# EAGLE design rings_v30 (EAGLE 5.09)

## Sheet 1 of 5
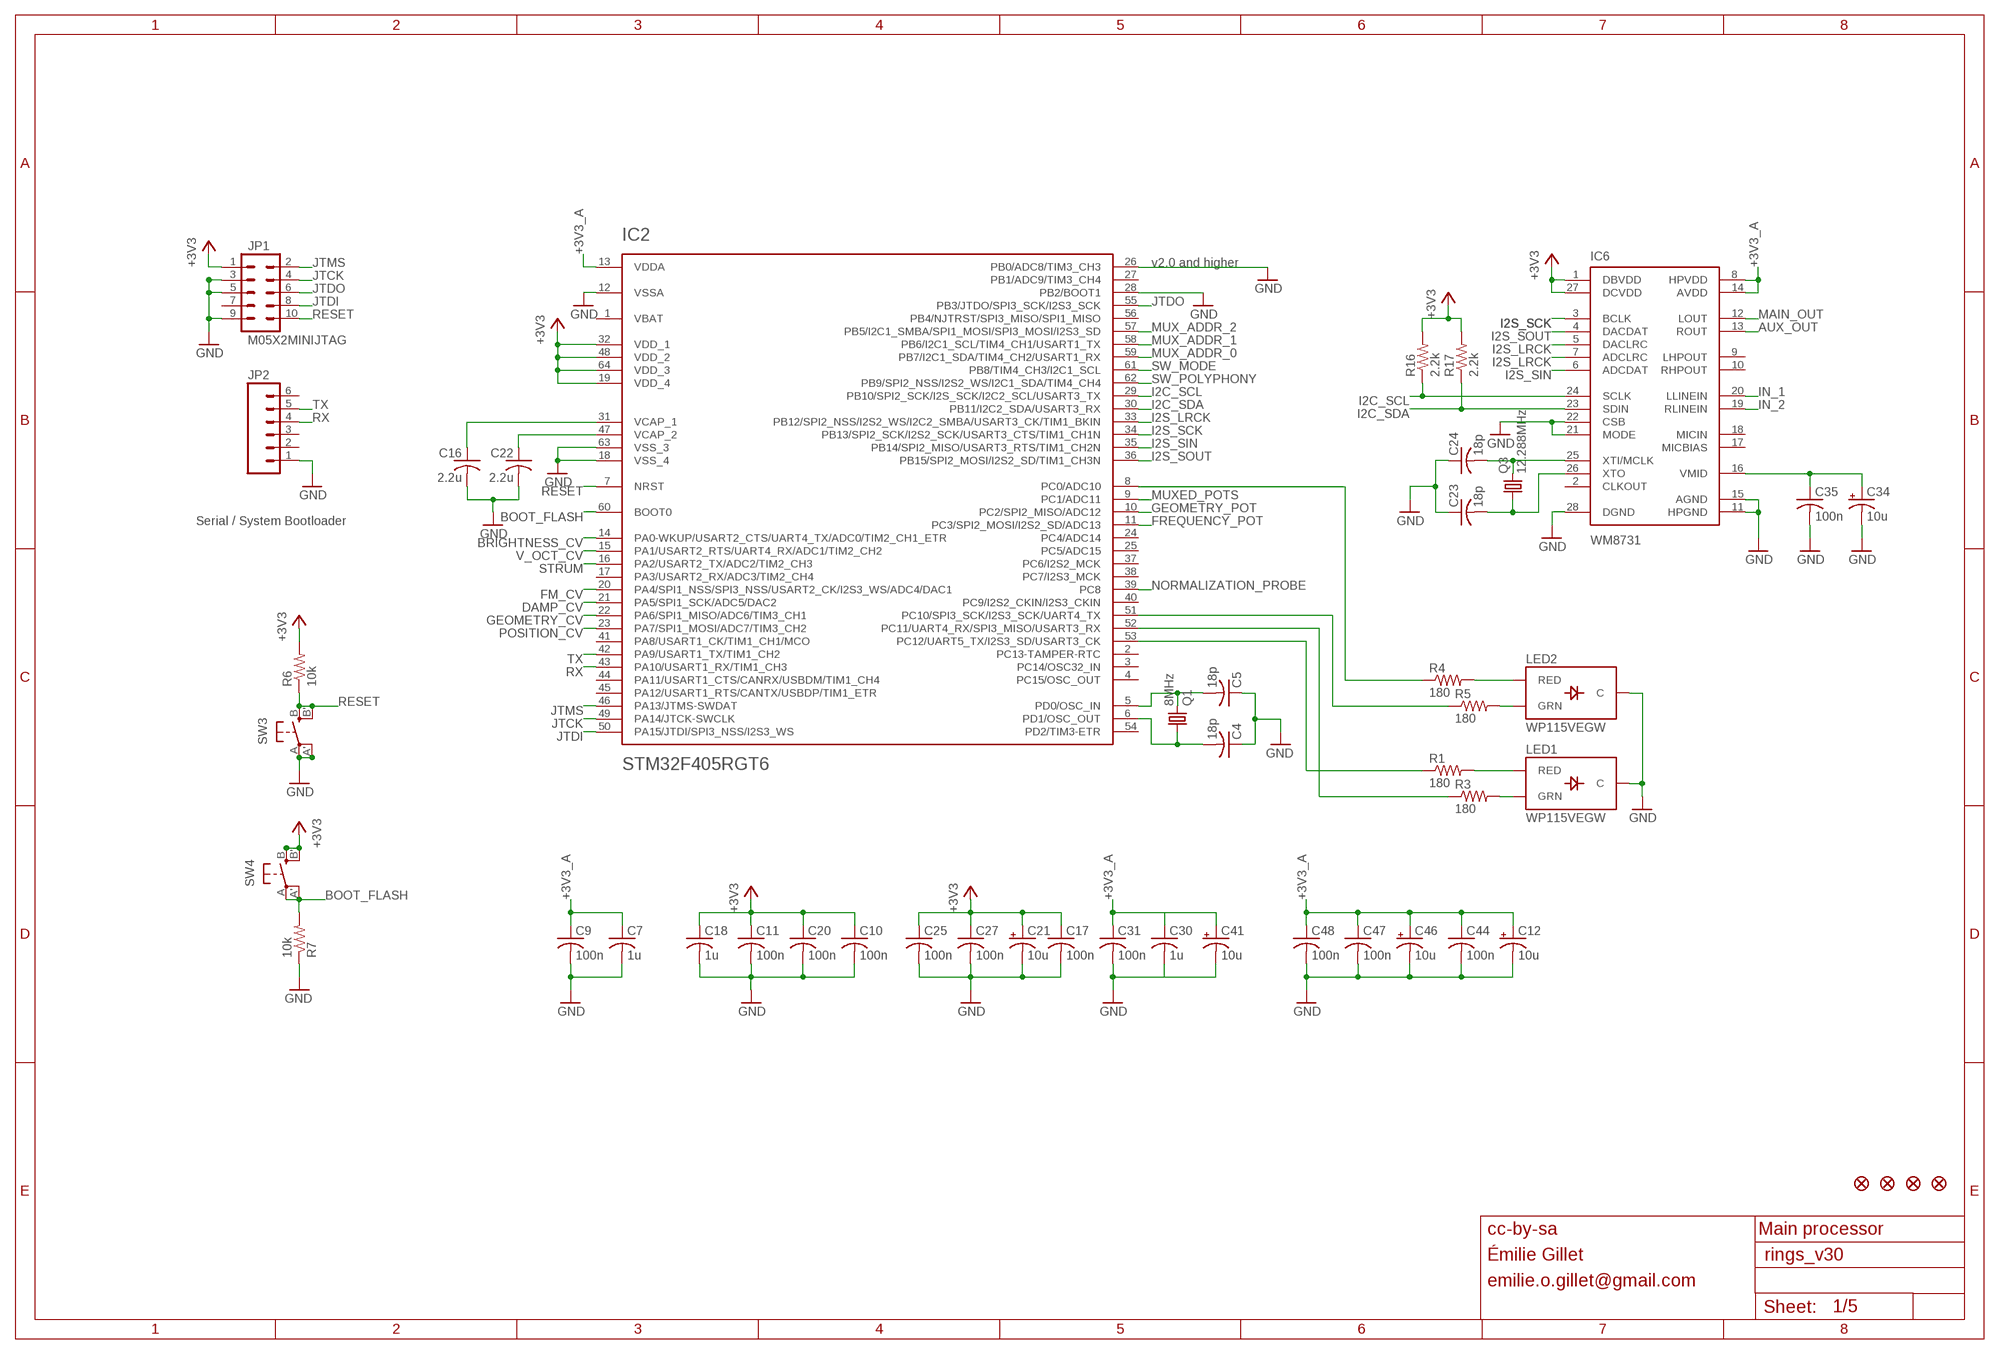
[diagram p0: schematic, sheet 1]

### Parts
C4  18p  C-USC0603  [C0603]
C5  18p  C-USC0603  [C0603]
C7  1u  C-USC0603  [C0603]
C9  100n  C-USC0603  [C0603]
C10  100n  C-USC0603  [C0603]
C11  100n  C-USC0603  [C0603]
C12  10u  CPOL-USA  [PANASONIC_A]
C16  2.2u  C-USC0805  [C0805]
C17  100n  C-USC0603  [C0603]
C18  1u  C-USC0603  [C0603]
C20  100n  C-USC0603  [C0603]
C21  10u  CPOL-USA  [PANASONIC_A]
C22  2.2u  C-USC0805  [C0805]
C23  18p  C-USC0603  [C0603]
C24  18p  C-USC0603  [C0603]
C25  100n  C-USC0603  [C0603]
C27  100n  C-USC0603  [C0603]
C30  1u  C-USC0603  [C0603]
C31  100n  C-USC0603  [C0603]
C34  10u  CPOL-USA  [PANASONIC_A]
C35  100n  C-USC0603  [C0603]
C41  10u  CPOL-USA  [PANASONIC_A]
C44  100n  C-USC0603  [C0603]
C46  10u  CPOL-USA  [PANASONIC_A]
C47  100n  C-USC0603  [C0603]
C48  100n  C-USC0603  [C0603]
F1  FIDUCIAL1X2  [FIDUCIAL-1X2]
F2  FIDUCIAL1X2  [FIDUCIAL-1X2]
F3  FIDUCIAL1X2  [FIDUCIAL-1X2]
F4  FIDUCIAL1X2  [FIDUCIAL-1X2]
IC2  STM32F405RGT6  STM32F20X  [TQFP-10X10-64]
IC6  WM8731  [SSOP28]
JP1  M05X2MINIJTAG  [2X5-1.27]
JP2  M06SIP  [1X06]
LED1  WP115VEGW  LED-BICOLOR-THROUGHHOLE  [LED-BICOLOR-THROUGHHOLE]
LED2  WP115VEGW  LED-BICOLOR-THROUGHHOLE  [LED-BICOLOR-THROUGHHOLE]
Q1  8MHz  CRYSTALHC49UP  [HC49UP]
Q3  12.288MHz  CRYSTALHC49UP  [HC49UP]
R1  180  R-US_R0603  [R0603]
R3  180  R-US_R0603  [R0603]
R4  180  R-US_R0603  [R0603]
R5  180  R-US_R0603  [R0603]
R6  10k  R-US_R0603  [R0603]
R7  10k  R-US_R0603  [R0603]
R16  2.2k  R-US_R0603  [R0603]
R17  2.2k  R-US_R0603  [R0603]
SW3  EVQQ2  [EVQ-Q2]
SW4  EVQQ2  [EVQ-Q2]

### Nets
+3V3: C10.1 C11.1 C17.1 C18.1 C20.1 C21.+ C25.1 C27.1 IC2.19(VDD_4) IC2.32(VDD_1) IC2.48(VDD_2) IC2.64(VDD_3) IC6.1(DBVDD) IC6.27(DCVDD) JP1.1 R6.2 R16.2 R17.2 SW4.B'(S1) SW4.B(S) ; also sheet 4,5
+3V3_A: C7.1 C9.1 C12.+ C30.1 C31.1 C41.+ C44.1 C46.+ C47.1 C48.1 IC2.13(VDDA) IC6.8(HPVDD) IC6.14(AVDD) ; also sheet 2,3,5
AUX_OUT: IC6.13(ROUT) ; also sheet 4
BOOT_FLASH: IC2.60(BOOT0) R7.2 SW4.A'(P1) SW4.A(P)
BRIGHTNESS_CV: IC2.14(PA0-WKUP/USART2_CTS/UART4_TX/ADC0/TIM2_CH1_ETR) ; also sheet 3
DAMP_CV: IC2.21(PA5/SPI1_SCK/ADC5/DAC2) ; also sheet 3
FM_CV: IC2.20(PA4/SPI1_NSS/SPI3_NSS/USART2_CK/I2S3_WS/ADC4/DAC1) ; also sheet 3
FREQUENCY_POT: IC2.11(PC3/SPI2_MOSI/I2S2_SD/ADC13) ; also sheet 2
GEOMETRY_CV: IC2.22(PA6/SPI1_MISO/ADC6/TIM3_CH1) ; also sheet 3
GEOMETRY_POT: IC2.10(PC2/SPI2_MISO/ADC12) ; also sheet 2
GND: C4.1 C5.1 C7.2 C9.2 C10.2 C11.2 C12.- C16.2 C17.2 C18.2 C20.2 C21.- C22.2 C23.1 C24.1 C25.2 C27.2 C30.2 C31.2 C34.- C35.2 C41.- C44.2 C46.- C47.2 C48.2 IC2.12(VSSA) IC2.18(VSS_4) IC2.26(PB0/ADC8/TIM3_CH3) IC2.28(PB2/BOOT1) IC2.63(VSS_3) IC6.11(HPGND) IC6.15(AGND) IC6.21(MODE) IC6.22(CSB) IC6.28(DGND) JP1.3 JP1.5 JP1.9 JP2.1 LED1.2(C) LED2.2(C) R7.1 SW3.A'(P1) SW3.A(P) ; also sheet 2,3,4,5
I2C_SCL: IC2.29(PB10/SPI2_SCK/I2S_SCK/I2C2_SCL/USART3_TX) IC6.24(SCLK) R16.1
I2C_SDA: IC2.30(PB11/I2C2_SDA/USART3_RX) IC6.23(SDIN) R17.1
I2S_LRCK: IC2.33(PB12/SPI2_NSS/I2S2_WS/I2C2_SMBA/USART3_CK/TIM1_BKIN) IC6.5(DACLRC) IC6.7(ADCLRC)
I2S_SCK: IC2.34(PB13/SPI2_SCK/I2S2_SCK/USART3_CTS/TIM1_CH1N) IC6.3(BCLK)
I2S_SIN: IC2.35(PB14/SPI2_MISO/USART3_RTS/TIM1_CH2N) IC6.6(ADCDAT)
I2S_SOUT: IC2.36(PB15/SPI2_MOSI/I2S2_SD/TIM1_CH3N) IC6.4(DACDAT)
IN_1: IC6.20(LLINEIN) ; also sheet 4
IN_2: IC6.19(RLINEIN) ; also sheet 4
JTCK: IC2.49(PA14/JTCK-SWCLK) JP1.4
JTDI: IC2.50(PA15/JTDI/SPI3_NSS/I2S3_WS) JP1.8
JTDO: IC2.55(PB3/JTDO/SPI3_SCK/I2S3_SCK) JP1.6
JTMS: IC2.46(PA13/JTMS-SWDAT) JP1.2
MAIN_OUT: IC6.12(LOUT) ; also sheet 4
MUX_ADDR_0: IC2.59(PB7/I2C1_SDA/TIM4_CH2/USART1_RX) ; also sheet 2
MUX_ADDR_1: IC2.58(PB6/I2C1_SCL/TIM4_CH1/USART1_TX) ; also sheet 2
MUX_ADDR_2: IC2.57(PB5/I2C1_SMBA/SPI1_MOSI/SPI3_MOSI/I2S3_SD) ; also sheet 2
MUXED_POTS: IC2.9(PC1/ADC11) ; also sheet 2
N$7: C5.2 IC2.5(PD0/OSC_IN) Q1.2
N$8: C4.2 IC2.6(PD1/OSC_OUT) Q1.1
N$12: LED1.3(RED) R1.2
N$13: C22.1 IC2.47(VCAP_2)
N$17: C34.+ C35.1 IC6.16(VMID)
N$19: C16.1 IC2.31(VCAP_1)
N$22: LED1.1(GRN) R3.2
N$27: LED2.3(RED) R4.2
N$35: LED2.1(GRN) R5.2
N$37: IC2.52(PC11/UART4_RX/SPI3_MISO/USART3_RX) R3.1
N$40: IC2.8(PC0/ADC10) R4.1
N$41: C24.2 IC6.25(XTI/MCLK) Q3.2
N$42: C23.2 IC6.26(XTO) Q3.1
N$43: IC2.53(PC12/UART5_TX/I2S3_SD/USART3_CK) R1.1
N$44: IC2.51(PC10/SPI3_SCK/I2S3_SCK/UART4_TX) R5.1
NORMALIZATION_PROBE: IC2.39(PC8) ; also sheet 4
POSITION_CV: IC2.23(PA7/SPI1_MOSI/ADC7/TIM3_CH2) ; also sheet 3
RESET: IC2.7(NRST) JP1.10 R6.1 SW3.B'(S1) SW3.B(S)
RX: IC2.43(PA10/USART1_RX/TIM1_CH3) JP2.4
STRUM: IC2.16(PA2/USART2_TX/ADC2/TIM2_CH3) ; also sheet 4
SW_MODE: IC2.61(PB8/TIM4_CH3/I2C1_SCL) ; also sheet 2
SW_POLYPHONY: IC2.62(PB9/SPI2_NSS/I2S2_WS/I2C1_SDA/TIM4_CH4) ; also sheet 2
TX: IC2.42(PA9/USART1_TX/TIM1_CH2) JP2.5
V_OCT_CV: IC2.15(PA1/USART2_RTS/UART4_RX/ADC1/TIM2_CH2) ; also sheet 3
Unconnected: IC2.2(PC13-TAMPER-RTC) IC2.3(PC14/OSC32_IN) IC2.4(PC15/OSC_OUT) IC2.17(PA3/USART2_RX/ADC3/TIM2_CH4) IC2.24(PC4/ADC14) IC2.25(PC5/ADC15) IC2.27(PB1/ADC9/TIM3_CH4) IC2.37(PC6/I2S2_MCK) IC2.38(PC7/I2S3_MCK) IC2.40(PC9/I2S2_CKIN/I2S3_CKIN) IC2.41(PA8/USART1_CK/TIM1_CH1/MCO) IC2.44(PA11/USART1_CTS/CANRX/USBDM/TIM1_CH4) IC2.45(PA12/USART1_RTS/CANTX/USBDP/TIM1_ETR) IC2.54(PD2/TIM3-ETR) IC2.56(PB4/NJTRST/SPI3_MISO/SPI1_MISO) IC6.2(CLKOUT) IC6.9(LHPOUT) IC6.10(RHPOUT) IC6.17(MICBIAS) IC6.18(MICIN) JP1.7 JP2.2 JP2.3 JP2.6

### Notes on the sheet
- v2.0 and higher
- Serial / System Bootloader
- cc-by-sa | Main processor
- Émilie Gillet
- emilie.o.gillet@gmail.com

## Sheet 2 of 5
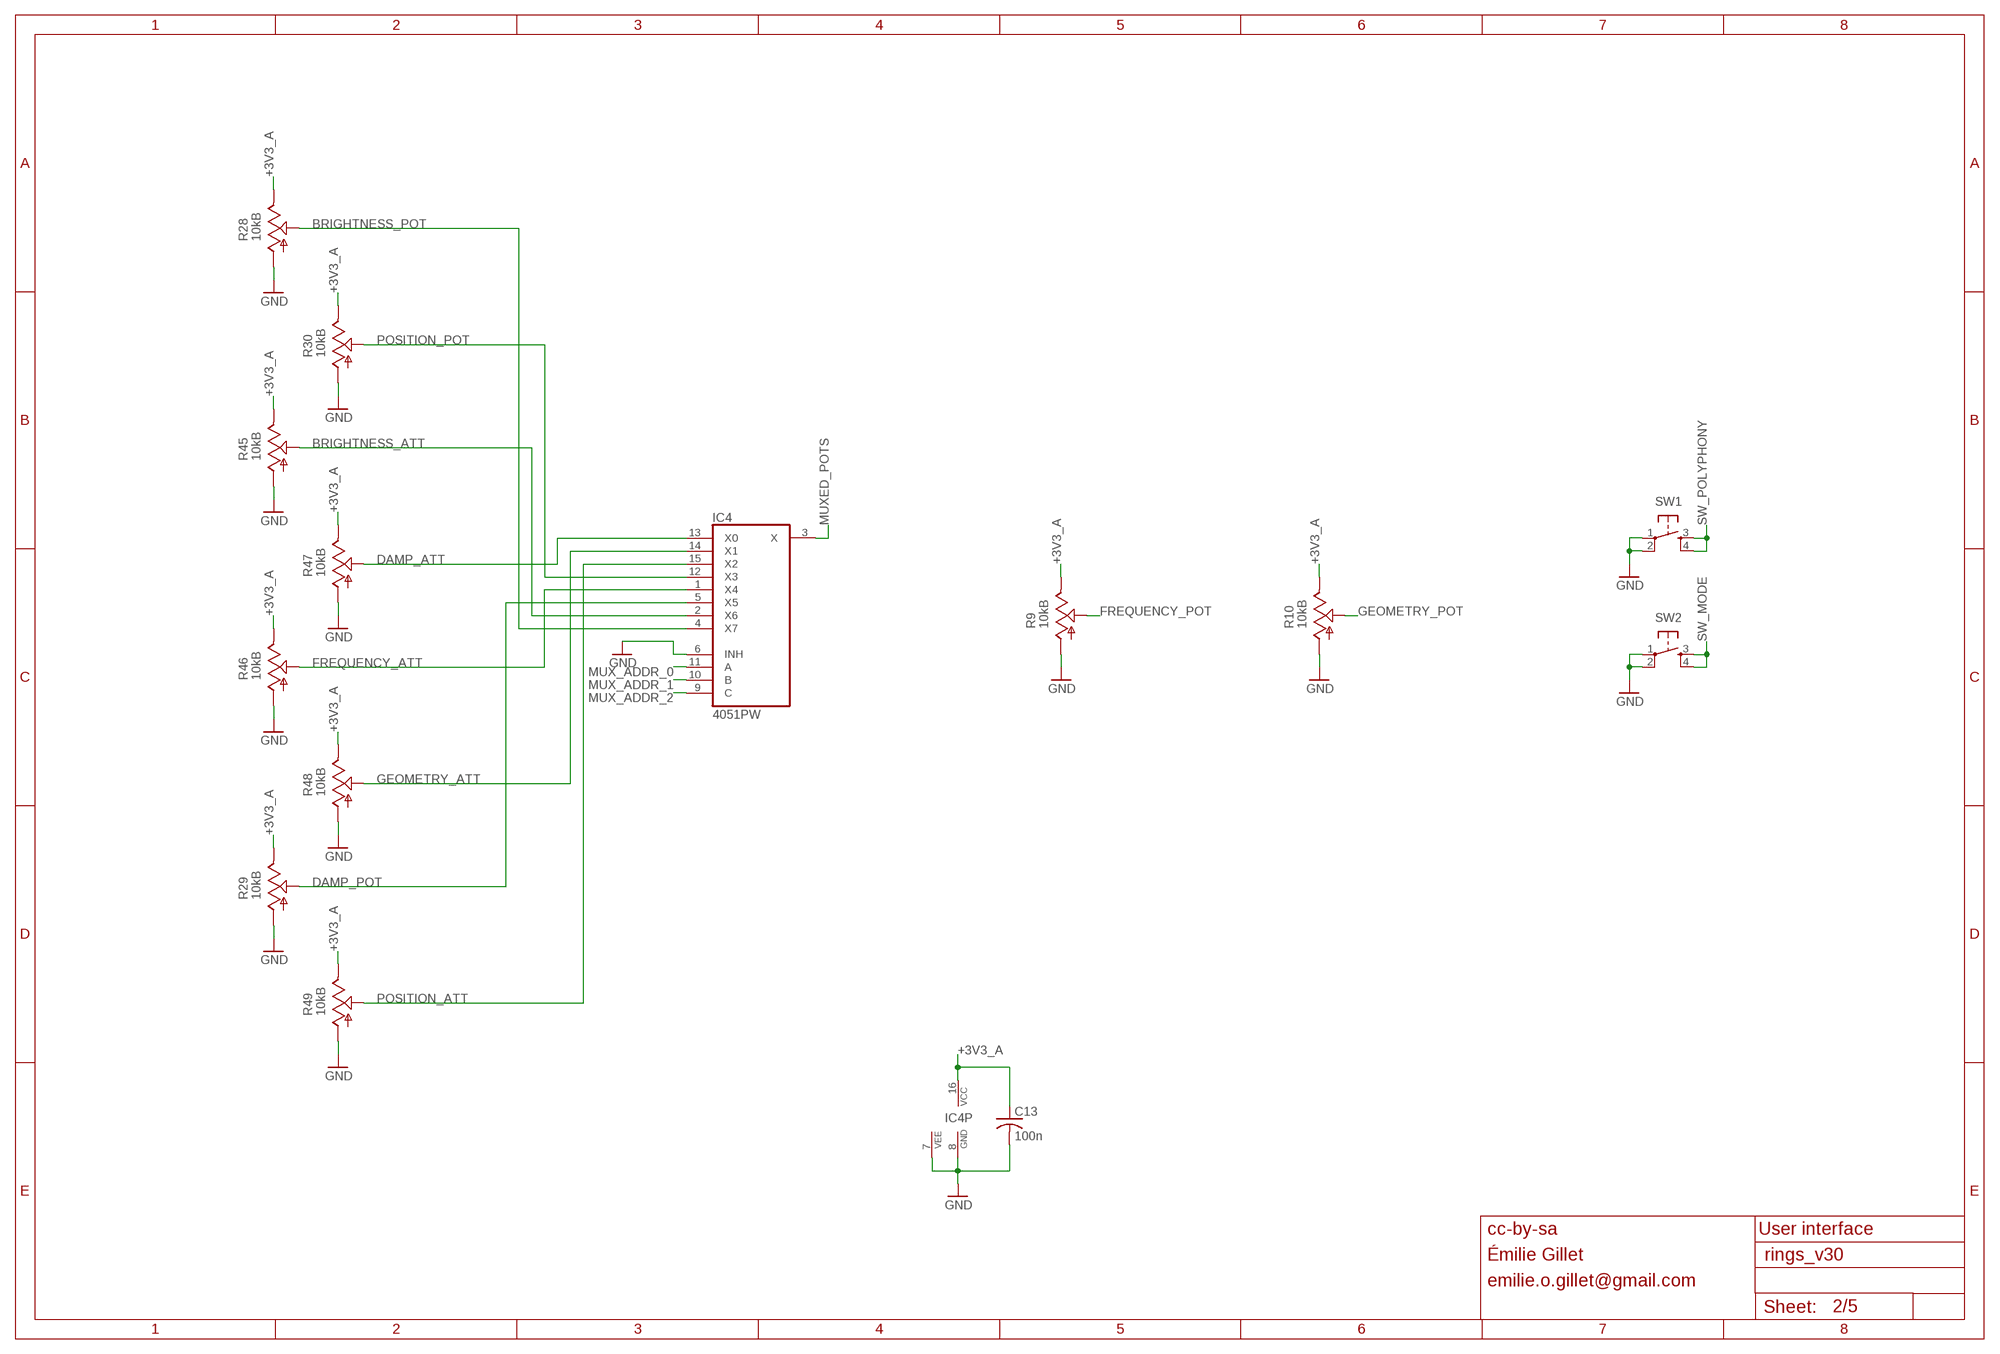
[diagram p1: schematic, sheet 2]

### Parts
C13  100n  C-USC0603  [C0603]
IC4  4051PW  [TSSOP16]
R9  10kB  POT_USVERTICAL_PS  [ALPS_POT_VERTICAL_PS]
R10  10kB  POT_USVERTICAL_PS  [ALPS_POT_VERTICAL_PS]
R28  10kB  POT_USVERTICAL_PS  [ALPS_POT_VERTICAL_PS]
R29  10kB  POT_USVERTICAL_PS  [ALPS_POT_VERTICAL_PS]
R30  10kB  POT_USVERTICAL_PS  [ALPS_POT_VERTICAL_PS]
R45  10kB  POT_USVERTICAL  [ALPS_POT_VERTICAL]
R46  10kB  POT_USVERTICAL  [ALPS_POT_VERTICAL]
R47  10kB  POT_USVERTICAL  [ALPS_POT_VERTICAL]
R48  10kB  POT_USVERTICAL  [ALPS_POT_VERTICAL]
R49  10kB  POT_USVERTICAL  [ALPS_POT_VERTICAL]
SW1  TAC_SWITCHPTH  [TACTILE-PTH]
SW2  TAC_SWITCHPTH  [TACTILE-PTH]

### Nets
+3V3_A: C13.1 IC4.16(VCC) R9.P$1(E) R10.P$1(E) R28.P$1(E) R29.P$1(E) R30.P$1(E) R45.P$1(E) R46.P$1(E) R47.P$1(E) R48.P$1(E) R49.P$1(E) ; also sheet 1,3,5
BRIGHTNESS_ATT: IC4.2(X6) R45.P$2(S)
BRIGHTNESS_POT: IC4.4(X7) R28.P$2(S)
DAMP_ATT: IC4.13(X0) R47.P$2(S)
DAMP_POT: IC4.5(X5) R29.P$2(S)
FREQUENCY_ATT: IC4.1(X4) R46.P$2(S)
FREQUENCY_POT: R9.P$2(S) ; also sheet 1
GEOMETRY_ATT: IC4.14(X1) R48.P$2(S)
GEOMETRY_POT: R10.P$2(S) ; also sheet 1
GND: C13.2 IC4.6(INH) IC4.7(VEE) IC4.8(GND) R9.P$3(A) R10.P$3(A) R28.P$3(A) R29.P$3(A) R30.P$3(A) R45.P$3(A) R46.P$3(A) R47.P$3(A) R48.P$3(A) R49.P$3(A) SW1.1 SW1.2 SW2.1 SW2.2 ; also sheet 1,3,4,5
MUX_ADDR_0: IC4.11(A) ; also sheet 1
MUX_ADDR_1: IC4.10(B) ; also sheet 1
MUX_ADDR_2: IC4.9(C) ; also sheet 1
MUXED_POTS: IC4.3(X) ; also sheet 1
POSITION_ATT: IC4.15(X2) R49.P$2(S)
POSITION_POT: IC4.12(X3) R30.P$2(S)
SW_MODE: SW2.3 SW2.4 ; also sheet 1
SW_POLYPHONY: SW1.3 SW1.4 ; also sheet 1

### Notes on the sheet
- cc-by-sa | User interface
- Émilie Gillet
- emilie.o.gillet@gmail.com

## Sheet 3 of 5
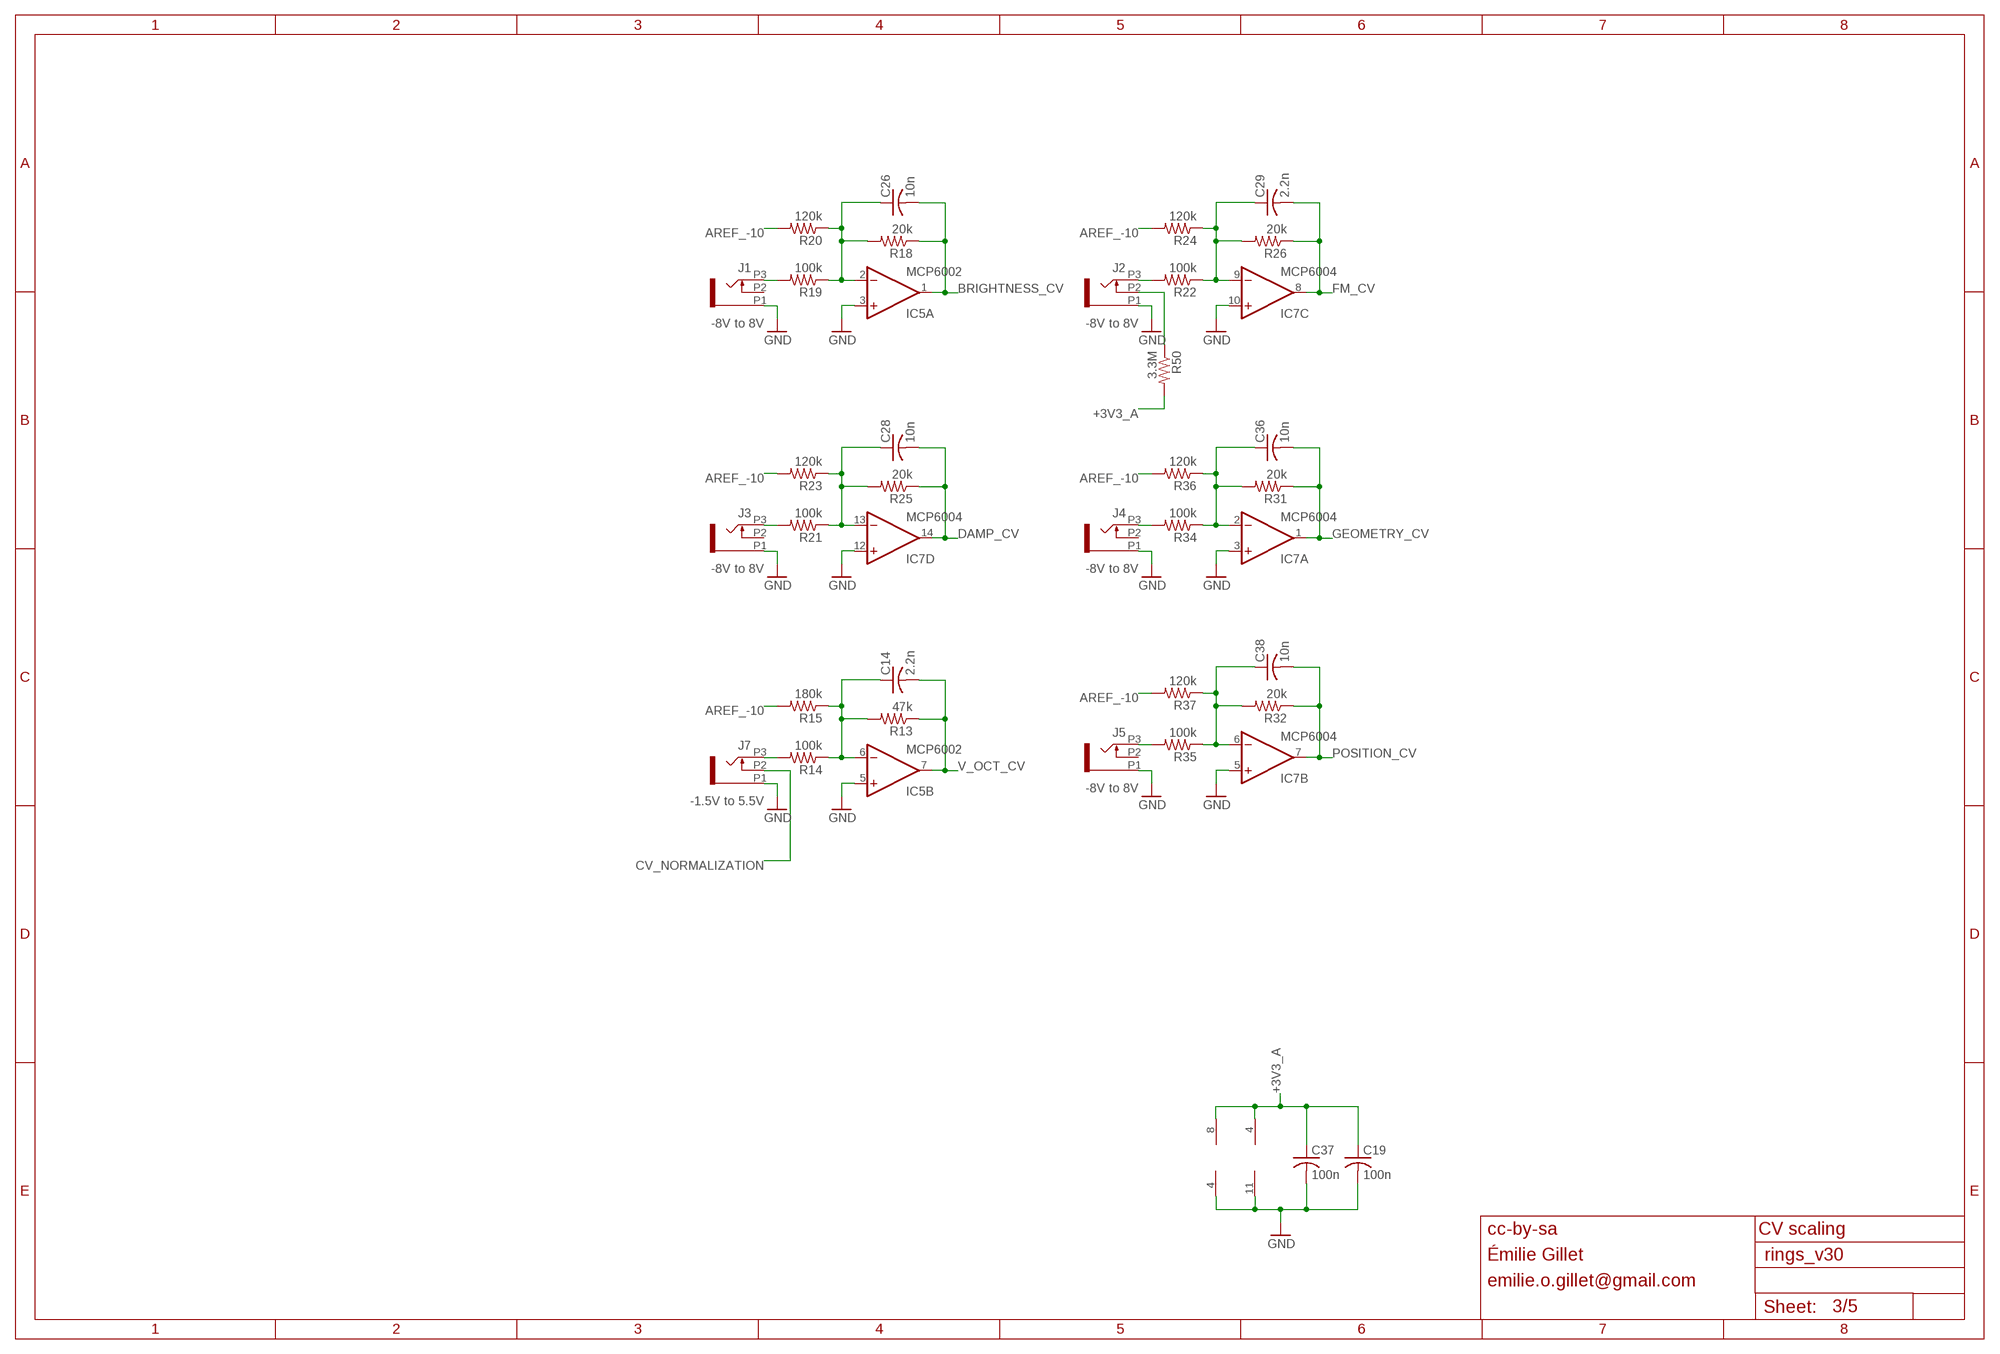
[diagram p2: schematic, sheet 3]

### Parts
C14  2.2n  C-USC0603  [C0603]
C19  100n  C-USC0603  [C0603]
C26  10n  C-USC0603  [C0603]
C28  10n  C-USC0603  [C0603]
C29  2.2n  C-USC0603  [C0603]
C36  10n  C-USC0603  [C0603]
C37  100n  C-USC0603  [C0603]
C38  10n  C-USC0603  [C0603]
IC5  MCP6002  TL072D  [SO08]
IC7  MCP6004  TL074D  [SO14]
J1  PJ301_THONKICONN6  [WQP_PJ_301M6]
J2  PJ301_THONKICONN6  [WQP_PJ_301M6]
J3  PJ301_THONKICONN6  [WQP_PJ_301M6]
J4  PJ301_THONKICONN6  [WQP_PJ_301M6]
J5  PJ301_THONKICONN6  [WQP_PJ_301M6]
J7  PJ301_THONKICONN6  [WQP_PJ_301M6]
R13  47k  R-US_R0603  [R0603]
R14  100k  R-US_R0603  [R0603]
R15  180k  R-US_R0603  [R0603]
R18  20k  R-US_R0603  [R0603]
R19  100k  R-US_R0603  [R0603]
R20  120k  R-US_R0603  [R0603]
R21  100k  R-US_R0603  [R0603]
R22  100k  R-US_R0603  [R0603]
R23  120k  R-US_R0603  [R0603]
R24  120k  R-US_R0603  [R0603]
R25  20k  R-US_R0603  [R0603]
R26  20k  R-US_R0603  [R0603]
R31  20k  R-US_R0603  [R0603]
R32  20k  R-US_R0603  [R0603]
R34  100k  R-US_R0603  [R0603]
R35  100k  R-US_R0603  [R0603]
R36  120k  R-US_R0603  [R0603]
R37  120k  R-US_R0603  [R0603]
R50  3.3M  R-US_R0603  [R0603]

### Nets
+3V3_A: C19.1 C37.1 IC5.8(P:V+) IC7.4(P:V+) R50.2 ; also sheet 1,2,5
AREF_-10: R15.2 R20.2 R23.2 R24.2 R36.2 R37.2 ; also sheet 5
BRIGHTNESS_CV: C26.2 IC5.1(A:OUT) R18.1 ; also sheet 1
CV_NORMALIZATION: J7.P2 ; also sheet 4
DAMP_CV: C28.2 IC7.14(D:OUT) R25.1 ; also sheet 1
FM_CV: C29.2 IC7.8(C:OUT) R26.1 ; also sheet 1
GEOMETRY_CV: C36.2 IC7.1(A:OUT) R31.1 ; also sheet 1
GND: C19.2 C37.2 IC5.3(A:+IN) IC5.4(P:V-) IC5.5(B:+IN) IC7.3(A:+IN) IC7.5(B:+IN) IC7.10(C:+IN) IC7.11(P:V-) IC7.12(D:+IN) J1.P1 J2.P1 J3.P1 J4.P1 J5.P1 J7.P1 ; also sheet 1,2,4,5
N$1: J1.P3 R19.2
N$2: C26.1 IC5.2(A:-IN) R18.2 R19.1 R20.1
N$3: J7.P3 R14.2
N$4: J2.P3 R22.2
N$5: C29.1 IC7.9(C:-IN) R22.1 R24.1 R26.2
N$6: J4.P3 R34.2
N$10: J3.P3 R21.2
N$11: C28.1 IC7.13(D:-IN) R21.1 R23.1 R25.2
N$14: C14.1 IC5.6(B:-IN) R13.2 R14.1 R15.1
N$15: C36.1 IC7.2(A:-IN) R31.2 R34.1 R36.1
N$26: J5.P3 R35.2
N$30: C38.1 IC7.6(B:-IN) R32.2 R35.1 R37.1
N$38: J2.P2 R50.1
POSITION_CV: C38.2 IC7.7(B:OUT) R32.1 ; also sheet 1
V_OCT_CV: C14.2 IC5.7(B:OUT) R13.1 ; also sheet 1
Unconnected: J1.P2 J3.P2 J4.P2 J5.P2

### Notes on the sheet
- -8V to 8V | -8V to 8V
- -8V to 8V | -8V to 8V
- -8V to 8V
- -1.5V to 5.5V
- cc-by-sa | CV scaling
- Émilie Gillet
- emilie.o.gillet@gmail.com

## Sheet 4 of 5
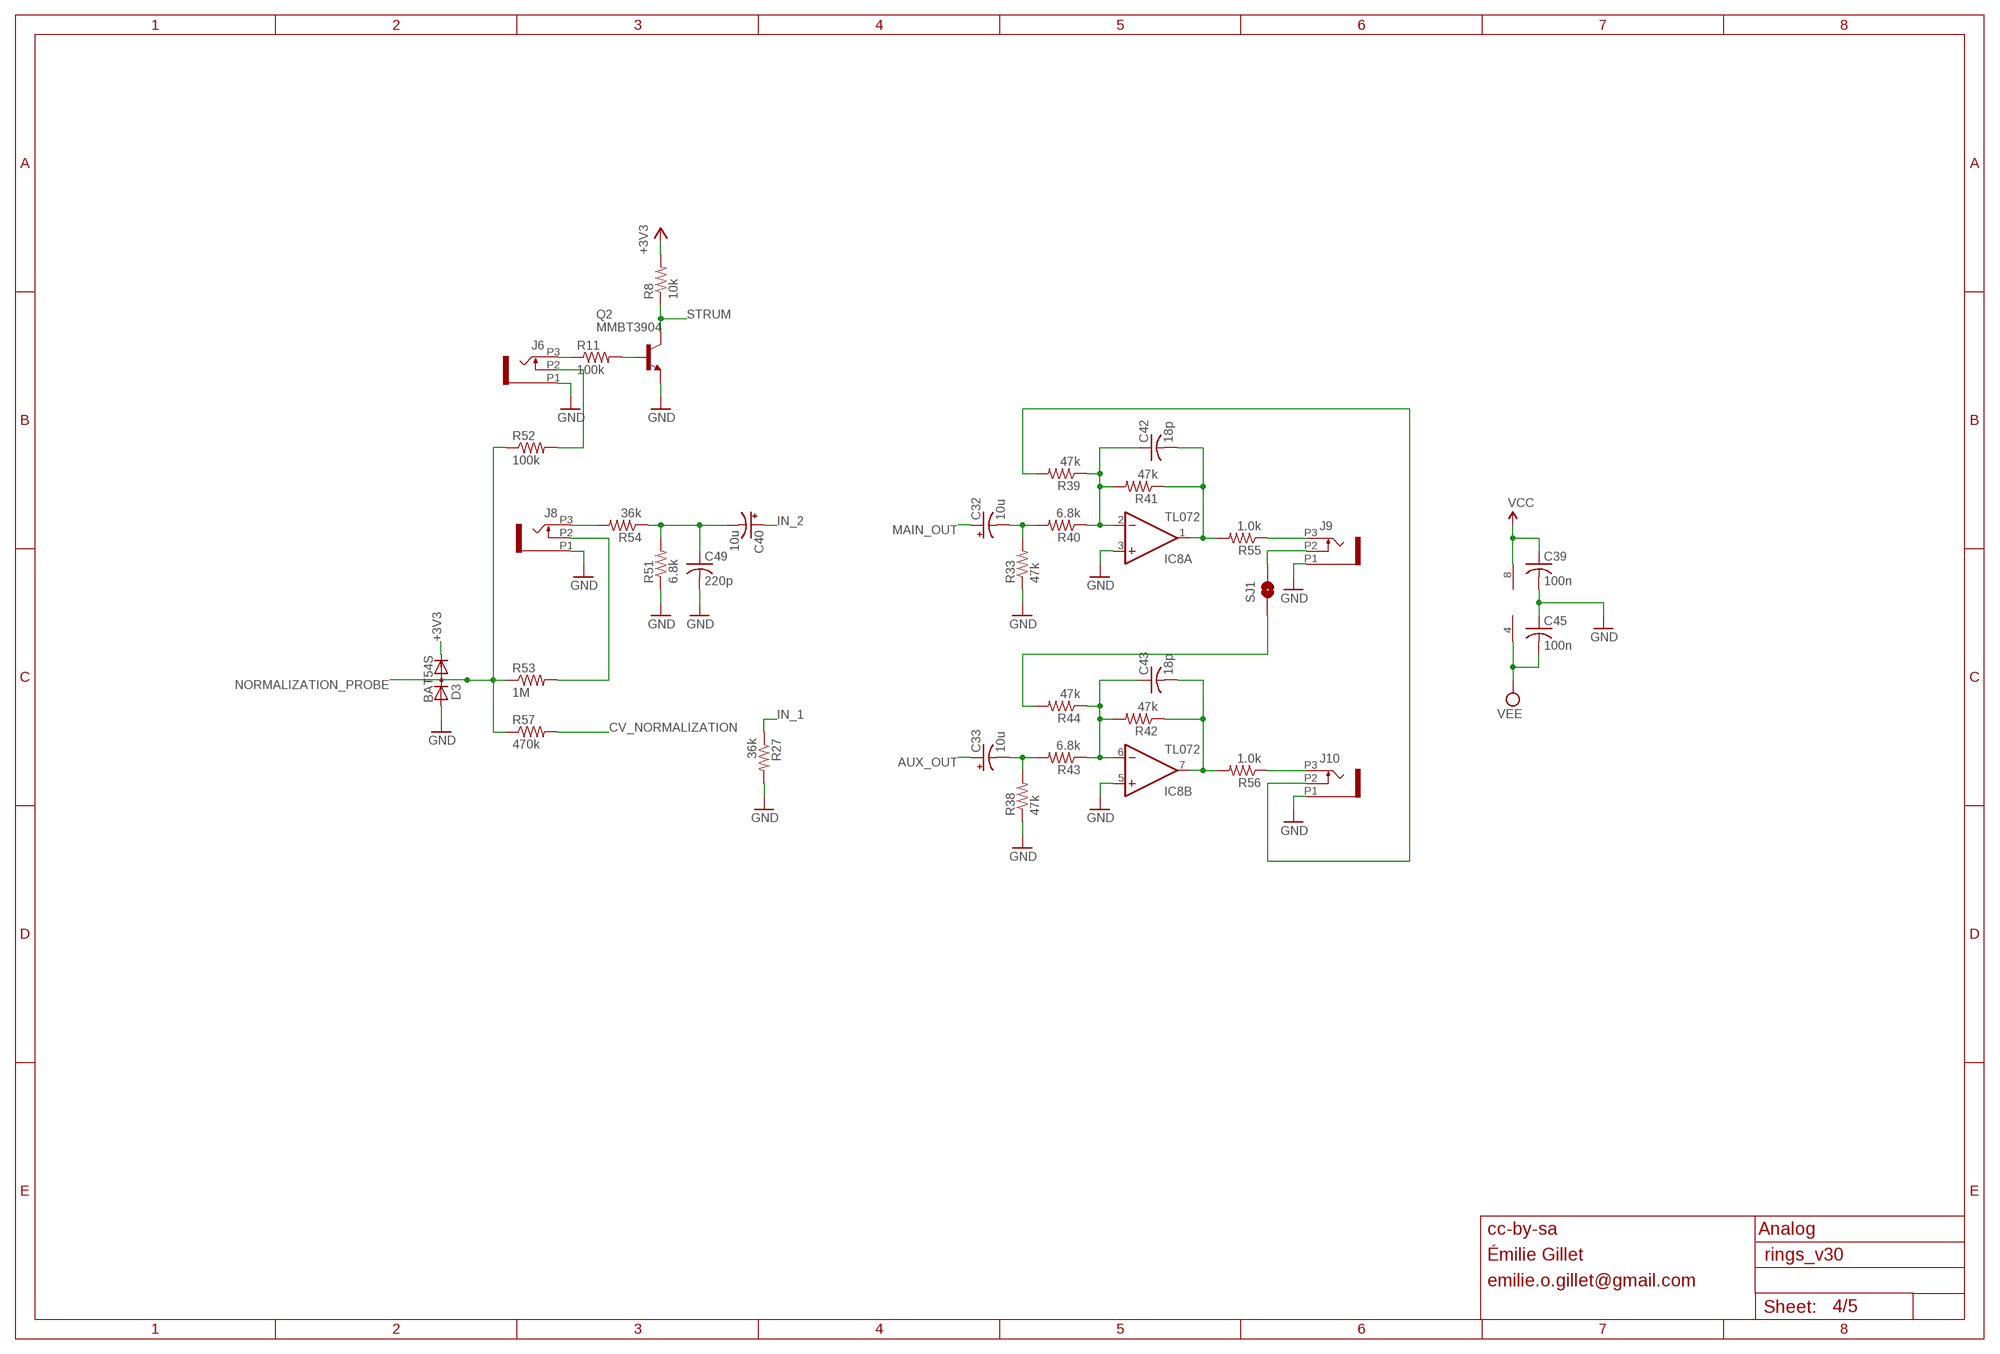
[diagram p3: schematic, sheet 4]

### Parts
C32  10u  CPOL-USA  [PANASONIC_A]
C33  10u  CPOL-USA  [PANASONIC_A]
C39  100n  C-USC0603  [C0603]
C40  10u  CPOL-USA  [PANASONIC_A]
C42  18p  C-USC0603  [C0603]
C43  18p  C-USC0603  [C0603]
C45  100n  C-USC0603  [C0603]
C49  220p  C-USC0603  [C0603]
D3  BAT54S  DIODE_2CACA-SOT23  [SOT23]
IC8  TL072  TL072D  [SO08]
J6  PJ301_THONKICONN6  [WQP_PJ_301M6]
J8  PJ301_THONKICONN6  [WQP_PJ_301M6]
J9  PJ301_THONKICONN6  [WQP_PJ_301M6]
J10  PJ301_THONKICONN6  [WQP_PJ_301M6]
Q2  MMBT3904  MMBT3904LT1-NPN-SOT23-BEC  [SOT23-BEC]
R8  10k  R-US_R0603  [R0603]
R11  100k  R-US_R0603  [R0603]
R27  36k  R-US_R0603  [R0603]
R33  47k  R-US_R0603  [R0603]
R38  47k  R-US_R0603  [R0603]
R39  47k  R-US_R0603  [R0603]
R40  6.8k  R-US_R0603  [R0603]
R41  47k  R-US_R0603  [R0603]
R42  47k  R-US_R0603  [R0603]
R43  6.8k  R-US_R0603  [R0603]
R44  47k  R-US_R0603  [R0603]
R51  6.8k  R-US_R0603  [R0603]
R52  100k  R-US_R0603  [R0603]
R53  1M  R-US_R0603  [R0603]
R54  36k  R-US_R0603  [R0603]
R55  1.0k  R-US_R0603  [R0603]
R56  1.0k  R-US_R0603  [R0603]
R57  470k  R-US_R0603  [R0603]
SJ1  SOLDERJUMPERNC2  [SJ_2S-NOTRACE]

### Nets
+3V3: D3.2(C) R8.2 ; also sheet 1,5
AUX_OUT: C33.+ ; also sheet 1
CV_NORMALIZATION: R57.2 ; also sheet 3
GND: C39.2 C45.1 C49.2 D3.1(A) IC8.3(A:+IN) IC8.5(B:+IN) J6.P1 J8.P1 J9.P1 J10.P1 Q2.E R27.2 R33.1 R38.1 R51.1 ; also sheet 1,2,3,5
IN_1: R27.1 ; also sheet 1
IN_2: C40.+ ; also sheet 1
MAIN_OUT: C32.+ ; also sheet 1
N$9: J6.P3 R11.1
N$18: C40.- C49.1 R51.2 R54.1
N$20: J6.P2 R52.2
N$21: J8.P3 R54.2
N$23: C33.- R38.2 R43.2
N$25: C43.1 IC8.6(B:-IN) R42.2 R43.1 R44.1
N$28: C43.2 IC8.7(B:OUT) R42.1 R56.2
N$29: J10.P3 R56.1
N$31: C32.- R33.2 R40.2
N$32: C42.1 IC8.2(A:-IN) R39.1 R40.1 R41.2
N$33: C42.2 IC8.1(A:OUT) R41.1 R55.2
N$34: J9.P3 R55.1
N$39: J8.P2 R53.2
N$45: J10.P2 R39.2
N$46: R44.2 SJ1.1
N$47: J9.P2 SJ1.2
N$66: Q2.B R11.2
NORMALIZATION_PROBE: D3.3(AC) R52.1 R53.1 R57.1 ; also sheet 1
STRUM: Q2.C R8.1 ; also sheet 1
VCC: C39.1 IC8.8(P:V+) ; also sheet 5
VEE: C45.2 IC8.4(P:V-) ; also sheet 5

### Notes on the sheet
- cc-by-sa | Analog
- Émilie Gillet
- emilie.o.gillet@gmail.com

## Sheet 5 of 5
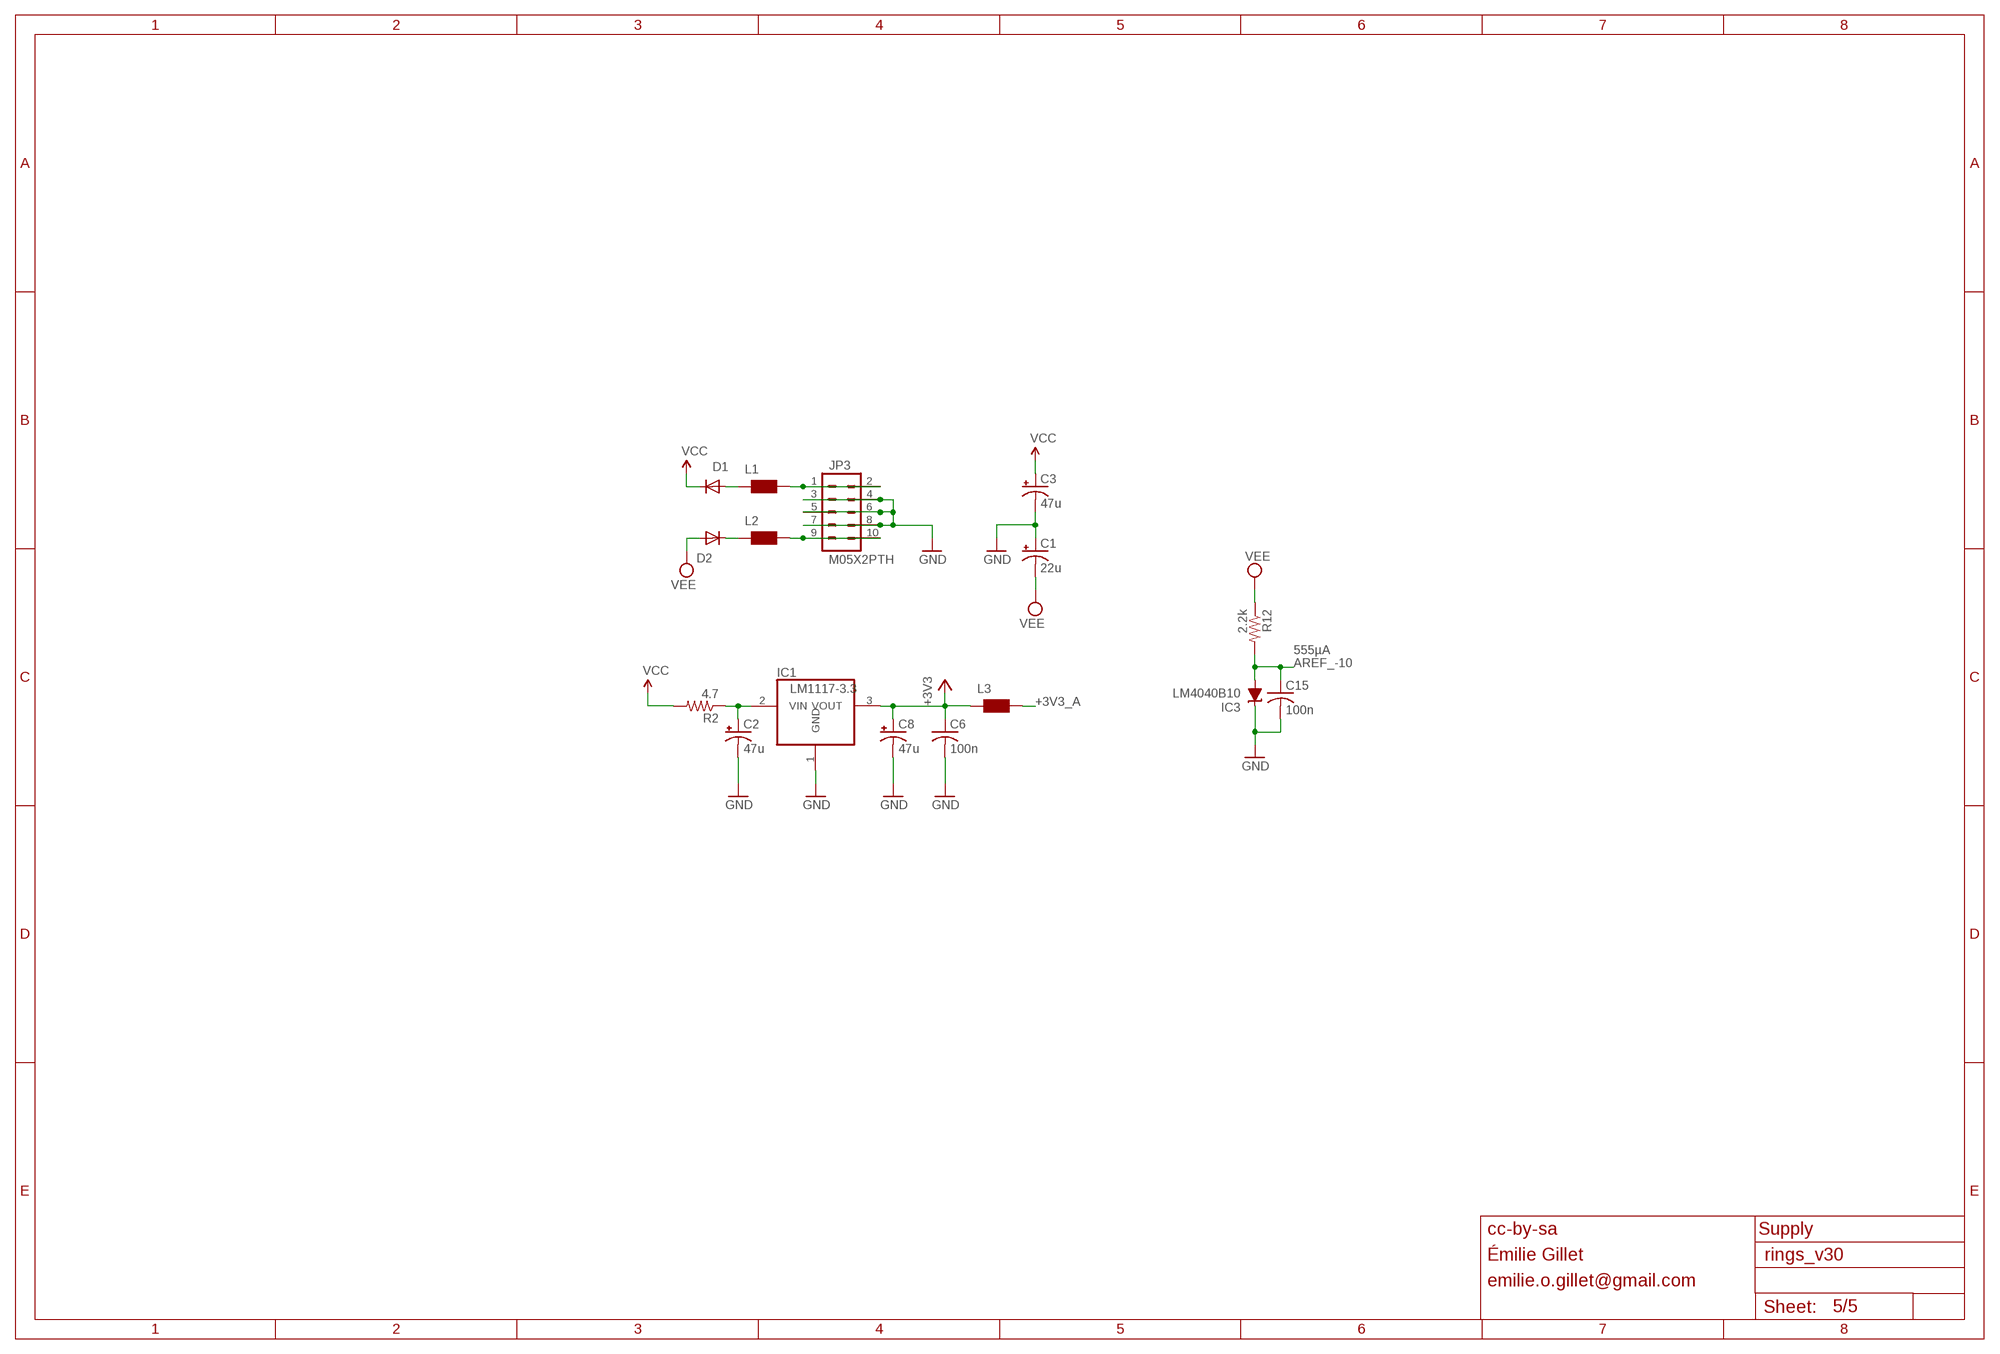
[diagram p4: schematic, sheet 5]

### Parts
C1  22u  CPOL-USC  [PANASONIC_C]
C2  47u  CPOL-USD  [PANASONIC_D]
C3  47u  CPOL-USD  [PANASONIC_D]
C6  100n  C-USC0603  [C0603]
C8  47u  CPOL-USD  [PANASONIC_D]
C15  100n  C-USC0603  [C0603]
D1  1N5819HW  DIODE-SOD123  [SOD123]
D2  1N5819HW  DIODE-SOD123  [SOD123]
IC1  LM1117-3.3  REG1117T  [TO252]
IC3  LM4040B10  LM4041B12DBZ  [DBZ_R-PDSO-G3]
JP3  M05X2PTH  [AVR_ICSP]
L1  WE-CBF_0603  [0603]
L2  WE-CBF_0603  [0603]
L3  WE-CBF_0603  [0603]
R2  4.7  R-US_R1206  [R1206]
R12  2.2k  R-US_R0603  [R0603]

### Nets
+3V3: C6.1 C8.+ IC1.3(VOUT) L3.1 ; also sheet 1,4
+3V3_A: L3.2 ; also sheet 1,2,3
AREF_-10: C15.1 IC3.2(A) R12.2 ; also sheet 3
GND: C1.+ C2.- C3.- C6.2 C8.- C15.2 IC1.1(GND) IC3.1(C) JP3.3 JP3.4 JP3.5 JP3.6 JP3.7 JP3.8 ; also sheet 1,2,3,4
N$16: C2.+ IC1.2(VIN) R2.1
N$24: D1.A L1.1
N$36: D2.C L2.1
N$56: JP3.1 JP3.2 L1.2
N$64: JP3.9 JP3.10 L2.2
VCC: C3.+ D1.C R2.2 ; also sheet 4
VEE: C1.- D2.A R12.1 ; also sheet 4

### Notes on the sheet
- 555µA
- cc-by-sa | Supply
- Émilie Gillet
- emilie.o.gillet@gmail.com

## Power pins joined to a net without a drawn wire
VBAT: IC2.1(VBAT)

## Library data of the parts
C1-C3 C8 C12 C21 C32-C34 C40 C41 C46 = rcl:CPOL-US: POLARIZED CAPACITOR, American symbol
C4-C7 C9-C11 C13-C20 C22-C31 C35-C39 C42-C45 C47-C49 = rcl:C-US: CAPACITOR, American symbol
D1 D2 = diode:DIODE-: DIODE
D3 = diode:DIODE_2CACA-: 2 Diodes - Cathode-Anode|Cathode-Anode
F1-F4 = SparkFun:FIDUCIAL: Fiducial Alignment Points Various fiducial points for machine vision alignment.
IC1 = og-vreg:REG1117: 800mA and 1A Low Dropout (LDO) Positive Regulator 1.8V, 2.5V, 2.85V, 3.3V, 5V, and Adj
IC2 = og-stm32f2:STM32F20X
IC3 = texas:LM4041: PRECISION MICROPOWER SHUNT VOLTAGE REFERENCE Source: http://focus.ti.com/lit/ds/slcs146e/slcs146e.pdf
IC4 = og-ics:4051: 8-channel ANALOG MULTIPLEXER
IC5 = gm-ics:TL072: OP AMP
IC6 = og-dac:WM8731
IC7 = gm-ics:TL074: OP AMP
IC8 = og-linear:TL072: OP AMP
J1-J10 = og-pj301:PJ301_THONKICONN
JP1 JP3 = og-header:M05X2: Header 5x2 Standard 10-pin dual row 0.1" header. Commonly used with AVR-ISP. Use with Spark Fun Electronics SKU: PRT-00778
JP2 = SparkFun:M06: Header 6 Standard 6-pin 0.1" header. Use with straight break away headers (SKU : PRT-00116), right angle break away headers (PRT-00553), swiss pins (PRT-00743), machine pins (PRT-00117), and female headers (PRT-00115). Molex polarized connector foot print use with SKU : PRT-08094 with associated crimp pins and housings. NOTES ON THE VARIANTS LOCK and LOCK_LONGPADS... This footprint was designed to help hold the alignment of a through-hole component (i.e. 6-pin header) while soldering it into place. You may notice that each hole has been shifted either up or down by 0.005 of an inch from it's more standard position (which is a perfectly straight line). This slight alteration caused the pins (the squares in the middle) to touch the edges of the holes. Because they are alternating, it causes a "brace" to hold the component in place. 0.005 has proven to be the perfect amount of "off-center" position when using our standard breakaway headers. Although looks a little odd when you look at the bare footprint, once you have a header in there, the alteration is very hard to notice. Also, if you push a header all the way into place, it is covered up entirely on the bottom side. This idea of altering the position of holes to aid alignment will be further integrated into the Sparkfun Library for other footprints. It can help hold any component with 3 or more connection pins.
L1-L3 = wuerth-elektronik:WE-CBF: SMD EMI Suppression Ferrite Beads - excellent anti-EMI properties - low DCR - impedances till 3000 ohms - rated current up to 6 A
LED1 LED2 = og-leds:LED-BICOLOR-THROUGHHOLE
Q1 Q3 = crystal:CRYSTAL: CRYSTAL
Q2 = transistor:*-NPN-: NPN Transistror BF959 corrected 2008.03.06
R1-R8 R11-R27 R31-R44 R50-R57 = rcl:R-US_: RESISTOR, American symbol
R9 R10 R28-R30 R45-R49 = og-pots:POT_US
SJ1 = SparkFun:SOLDERJUMPER: Solder Jumper Standard SMD solder jumper. Used to automate production. Two varients : Normally Open and Normally Closed are the same, but have different paste layers. NC will have a large amount of paste and should jumper during reflow.
SW1 SW2 = SparkFun:TAC_SWITCH: Momentary Switch Button commonly used for reset or general input. Spark Fun Electronics SKU : COM-00097
SW3 SW4 = adafruit:EVQQ2: SMT 6mm switch, EVQQ2 series http://www.ladyada.net/library/eagle

## Board
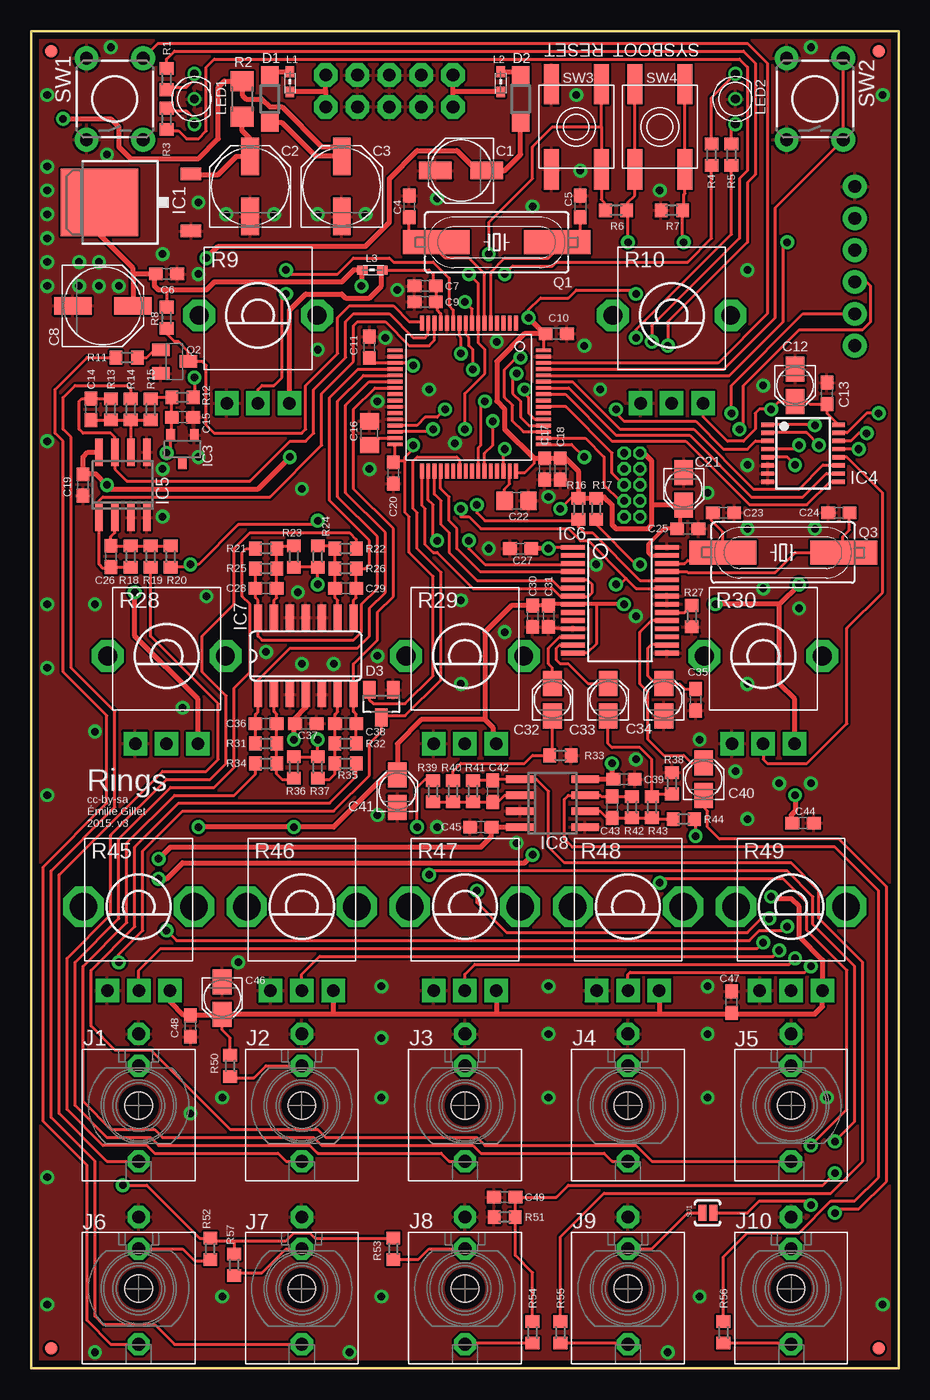
[diagram p5: board, top side]
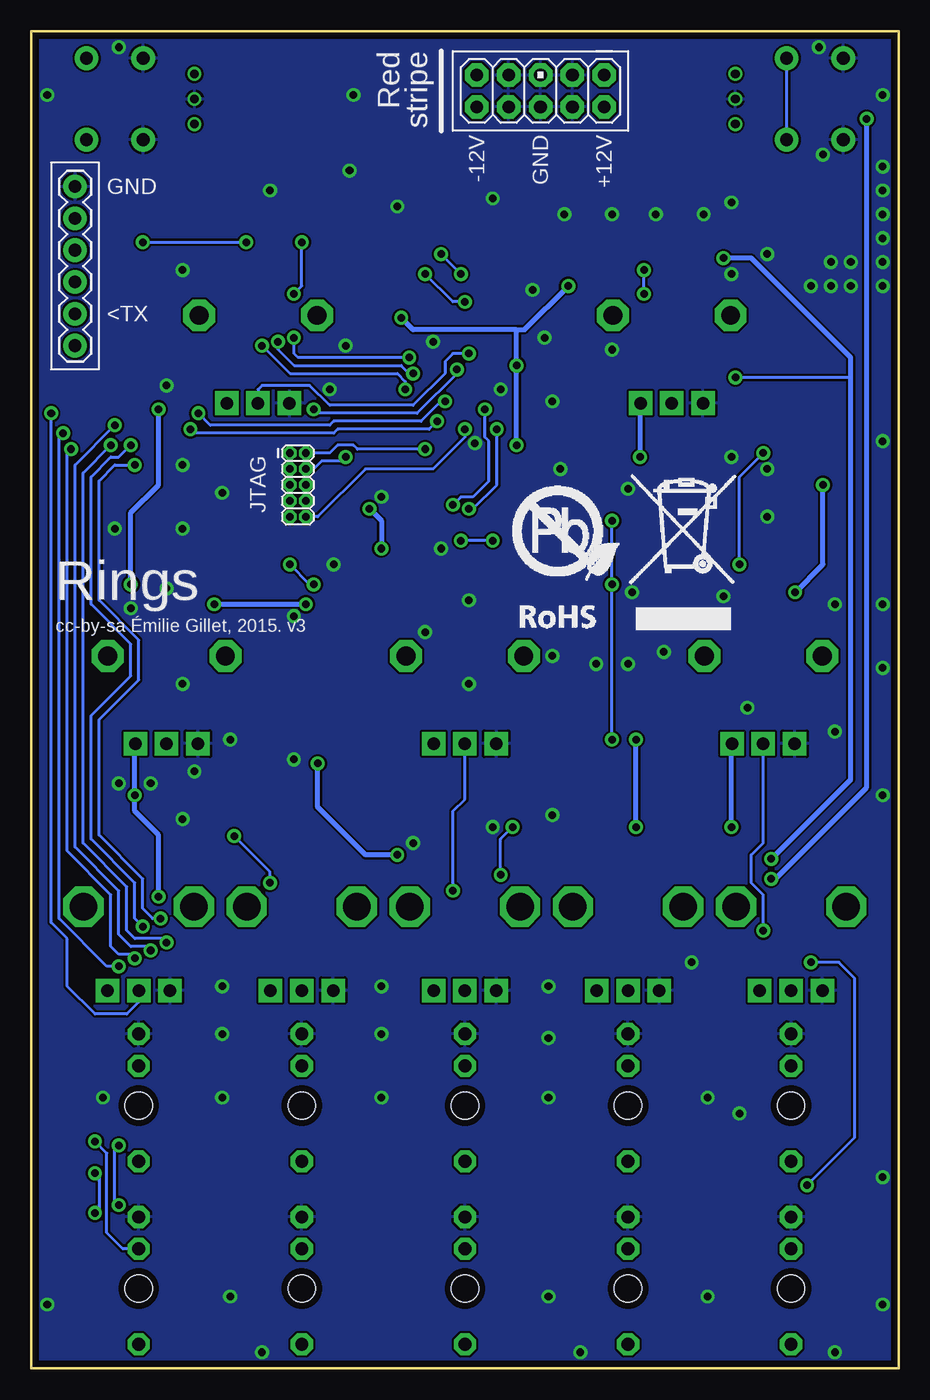
[diagram p6: board, bottom side, seen from below]

Size 69.22 x 106.68 mm. Coordinates in mm from the lower left corner, seen from the top.
Outline: 0,0 69.22,0 69.22,106.68 0,106.68 0,0
Copper layers (1*16): Top 0.035mm / dielectric 1.5mm / Bottom 0.035mm
Design rules "PCBCart-Standard-Fine": minimum track width 8mil, minimum drill 0.4mm, track to track 7mil, track to pad 7mil, pad to pad 7mil, via to via 7mil, smd to smd 7mil, copper to edge 20mil, drill to drill 8mil, minimum pad ring 8mil, minimum via ring 10mil, stop-mask expansion 3mil, vias tented up to drill 25mil, thermal gap 8mil

### Footprints (pad centres in the part's own frame; a part is rotated, then mirrored left to right if it is on the bottom)
PANASONIC_C = smd 2.6 x 1.4: + 2.05,0; - -2.05,0
PANASONIC_D = smd 3 x 1.4: + 2.4,0; - -2.4,0
C0603 = smd 1.1 x 1: 1 -0.85,0; 2 0.85,0
PANASONIC_A = smd 2 x 1.5: + 1.3,0; - -1.3,0
C0805 = smd 1.3 x 1.5: 1 -0.95,0; 2 0.95,0
SOD123 = smd 1.4 x 1.4: A 1.9,0; C -1.9,0
SOT23 = smd 1 x 1.4: 1 -0.95,-1.1; 2 0.95,-1.1; 3 0,1.1
FIDUCIAL-1X2 = smd 1 x 1: 1 0,0
TO252 = smd 1 x 1.6: 1 -2.28,-4.8; 2 2.28,-4.8 | smd 5.4 x 6.2: 3 0,2.5
TQFP-10X10-64 = smd 1.2 x 0.3: 1 -5.936,3.75; 2 -5.936,3.25; 3 -5.936,2.75; 4 -5.936,2.25; 5 -5.936,1.75; 6 -5.936,1.25; 7 -5.936,0.75; 8 -5.936,0.25; 9 -5.936,-0.25; 10 -5.936,-0.75; 11 -5.936,-1.25; 12 -5.936,-1.75; 13 -5.936,-2.25; 14 -5.936,-2.75; 15 -5.936,-3.25; 16 -5.936,-3.75; 33 5.886,-3.75; 34 5.886,-3.25; 35 5.886,-2.75; 36 5.886,-2.25; 37 5.886,-1.75; 38 5.886,-1.25; 39 5.886,-0.75; 40 5.886,-0.25; 41 5.886,0.25; 42 5.886,0.75; 43 5.886,1.25; 44 5.886,1.75; 45 5.886,2.25; 46 5.886,2.75; 47 5.886,3.25; 48 5.886,3.75 | smd 0.3 x 1.2: 17 -3.75,-5.911; 18 -3.25,-5.911; 19 -2.75,-5.911; 20 -2.25,-5.911; 21 -1.75,-5.911; 22 -1.25,-5.911; 23 -0.75,-5.911; 24 -0.25,-5.911; 25 0.25,-5.911; 26 0.75,-5.911; 27 1.25,-5.911; 28 1.75,-5.911; 29 2.25,-5.911; 30 2.75,-5.911; 31 3.25,-5.911; 32 3.75,-5.911; 49 3.75,5.936; 50 3.25,5.936; 51 2.75,5.936; 52 2.25,5.936; 53 1.75,5.936; 54 1.25,5.936; 55 0.75,5.936; 56 0.25,5.936; 57 -0.25,5.936; 58 -0.75,5.936; 59 -1.25,5.936; 60 -1.75,5.936; 61 -2.25,5.936; 62 -2.75,5.936; 63 -3.25,5.936; 64 -3.75,5.936
DBZ_R-PDSO-G3 = smd 0.7 x 1: 1 -0.95,-1.1; 2 0.95,-1.1; 3 0,1.1
TSSOP16 = smd 0.35 x 1: 1 -1.95,-2.825; 2 -1.3,-2.825; 3 -0.65,-2.825; 4 0,-2.825; 5 0.65,-2.825; 6 1.3,-2.825; 7 1.95,-2.825; 8 2.6,-2.825; 9 2.6,2.825; 10 1.95,2.825; 11 1.3,2.825; 12 0.65,2.825; 13 0,2.825; 14 -0.65,2.825; 15 -1.3,2.825; 16 -1.95,2.825
SO08 = smd 0.6 x 2.2: 1 -1.905,-2.6; 2 -0.635,-2.6; 3 0.635,-2.6; 4 1.905,-2.6; 5 1.905,2.6; 6 0.635,2.6; 7 -0.635,2.6; 8 -1.905,2.6
SSOP28 = smd 0.381 x 1.905: 1 -4.55,-3.752; 2 -3.9,-3.752; 3 -3.25,-3.752; 4 -2.6,-3.752; 5 -1.95,-3.752; 6 -1.3,-3.752; 7 -0.65,-3.752; 8 0,-3.752; 9 0.65,-3.752; 10 1.3,-3.752; 11 1.95,-3.752; 12 2.6,-3.752; 13 3.25,-3.752; 14 3.9,-3.752; 15 3.9,3.752; 16 3.25,3.752; 17 2.6,3.752; 18 1.95,3.752; 19 1.3,3.752; 20 0.65,3.752; 21 0,3.752; 22 -0.65,3.752; 23 -1.3,3.752; 24 -1.95,3.752; 25 -2.6,3.752; 26 -3.25,3.752; 27 -3.9,3.752; 28 -4.55,3.752
SO14 = smd 0.66 x 2.032: 1 -3.81,-3.073; 2 -2.54,-3.073; 3 -1.27,-3.073; 4 0,-3.073; 5 1.27,-3.073; 6 2.54,-3.073; 7 3.81,-3.073; 8 3.81,3.073; 9 2.54,3.073; 10 1.27,3.073; 11 0,3.073; 12 -1.27,3.073; 13 -2.54,3.073; 14 -3.81,3.073
WQP_PJ_301M6 = drill 1.016 pad 1.778 octagon: P1 0,-5.715; P2 0,-3.175; P3 0,4.445 | hole 2.2: 0,0
2X5-1.27 = drill 0.61 pad 1.067 octagon: 1 -1.27,3.81; 2 0,3.81; 3 -1.27,2.54; 4 0,2.54; 5 -1.27,1.27; 6 0,1.27; 7 -1.27,0; 8 0,0; 9 -1.27,-1.27; 10 0,-1.27
1X06 = drill 1.016 pad 1.88: 1 0,0; 2 2.54,0; 3 5.08,0; 4 7.62,0; 5 10.16,0; 6 12.7,0
AVR_ICSP = drill 1.016 pad 1.88 octagon: 1 -1.27,5.08; 2 1.27,5.08; 3 -1.27,2.54; 4 1.27,2.54; 5 -1.27,0; 6 1.27,0; 7 -1.27,-2.54; 8 1.27,-2.54; 9 -1.27,-5.08; 10 1.27,-5.08
0603 = smd 0.85 x 0.7: 1 -0.9,0; 2 0.7,0
LED-BICOLOR-THROUGHHOLE = drill 0.7: 1 -2,0; 2 0,0; 3 2,0
HC49UP = smd 5.334 x 1.93: 1 -4.826,0; 2 4.826,0
SOT23-BEC = smd 1 x 1.4: B -0.95,-1.1; C 0,1.1; E 0.95,-1.1
R0603 = smd 1 x 1.1: 1 -0.85,0; 2 0.85,0
R1206 = smd 1.6 x 1.803: 1 -1.422,0; 2 1.422,0
ALPS_POT_VERTICAL_PS = drill 1 pad 1.88 square: P$1 -2.5,7; P$2 0,7; P$3 2.5,7 | drill 1.5 pad 2.54 octagon: P$4 -4.7,0; P$5 4.7,0
ALPS_POT_VERTICAL = drill 1 pad 1.88 square: P$1 -2.5,6.7; P$2 0,6.7; P$3 2.5,6.7 | drill 2.2 pad 3.175 octagon: P$4 -4.4,0; P$5 4.4,0
SJ_2S-NOTRACE = smd 0.635 x 1.27: 1 -0.45,0; 2 0.4,0
TACTILE-PTH = drill 1.016 pad 1.88: 1 -3.251,2.261; 2 3.251,2.261; 3 -3.251,-2.261; 4 3.251,-2.261
EVQ-Q2 = smd 3.2 x 1.2: A -3.4,-2; A' 3.4,-2; B -3.4,2; B' 3.4,2

### Placement (x,y rotation side)
C1  34.29,95.57 180 top
C2  17.46,94.3 90 top
C3  24.77,94.3 90 top
C4  30.16,92.71 270 top
C5  43.81,92.71 270 top
C6  10.79,87.31 0 top
C7  31.43,86.36 180 top
C8  5.71,84.77 0 top
C9  31.43,85.09 180 top
C10  41.91,82.55 0 top
C11  26.99,81.47 90 top
C12  60.96,78.42 270 top
C13  63.5,77.79 90 top
C14  4.76,76.52 90 top
C15  12.06,75.88 0 top
C16  26.99,74.61 90 top
C17  40.96,71.75 270 top
C18  42.23,71.75 270 top
C19  4.13,70.48 270 top
C20  28.89,71.44 270 top
C21  52.07,70.17 270 top
C22  38.73,69.22 0 top
C23  55.24,68.26 180 top
C24  64.45,68.26 0 top
C25  52.39,66.99 0 top
C26  6.35,64.77 270 top
C27  39.05,65.41 180 top
C28  18.73,62.23 180 top
C29  25.08,62.23 0 top
C30  40.01,60.01 270 top
C31  41.27,60.01 270 top
C32  41.59,53.34 90 top
C33  46.04,53.34 90 top
C34  50.48,53.34 90 top
C35  53.02,53.34 270 top
C36  18.73,51.44 180 top
C37  21.91,51.44 0 top
C38  25.08,51.44 0 top
C39  47.31,46.99 0 top
C40  53.66,46.99 90 top
C41  29.21,46.04 90 top
C42  36.83,46.04 90 top
C43  46.35,44.77 90 top
C44  61.59,43.5 0 top
C45  35.88,43.18 0 top
C46  15.24,29.53 270 top
C47  55.88,29.21 90 top
C48  12.7,27.3 270 top
C49  37.78,13.65 180 top
D1  19.05,101.28 90 top
D2  39.05,101.28 270 top
D3  27.94,53.02 180 top
F1  1.59,105.09 0 top
F2  67.63,105.09 0 top
F3  1.59,1.59 0 top
F4  67.63,1.59 0 top
IC1  7.94,93.03 90 top
IC2  34.92,77.47 270 top
IC3  12.06,73.34 180 top
IC4  61.59,73.34 270 top
IC5  7.3,70.48 0 top
IC6  46.99,60.96 270 top
IC7  21.91,56.83 0 top
IC8  41.59,45.09 270 top
J1  8.57,20.95 180 top
J2  21.59,20.95 180 top
J3  34.61,20.95 180 top
J4  47.62,20.95 180 top
J5  60.64,20.95 180 top
J6  8.57,6.35 180 top
J7  21.59,6.35 180 top
J8  34.61,6.35 180 top
J9  47.62,6.35 180 top
J10  60.64,6.35 180 top
JP1  47.31,69.22 0 bottom
JP2  65.72,94.3 270 bottom
JP3  28.57,101.92 270 bottom
L1  20.64,102.55 270 top
L2  37.47,102.55 270 top
L3  27.3,87.63 0 top
LED1  13.02,101.28 90 top
LED2  56.2,101.28 90 top
Q1  37.15,89.85 0 top
Q2  11.43,80.33 270 top
Q3  60.01,65.09 0 top
R1  10.79,102.87 270 top
R2  16.83,101.28 90 top
R3  10.79,99.69 90 top
R4  54.29,96.84 90 top
R5  55.88,96.84 90 top
R6  46.67,92.39 0 top
R7  51.12,92.39 0 top
R8  10.79,83.82 90 top
R9  18.1,84.01 180 top
R10  51.12,84.01 180 top
R11  7.62,80.64 0 top
R12  12.06,77.47 180 top
R13  6.35,76.52 270 top
R14  7.94,76.52 90 top
R15  9.53,76.52 90 top
R16  43.66,68.58 90 top
R17  45.09,68.58 90 top
R18  7.94,64.77 90 top
R19  9.53,64.77 270 top
R20  11.11,64.77 270 top
R21  18.73,65.41 180 top
R22  25.08,65.41 0 top
R23  20.95,64.77 270 top
R24  22.86,64.77 270 top
R25  18.73,63.82 0 top
R26  25.08,63.82 180 top
R27  52.7,60.01 270 top
R28  10.79,56.83 180 top
R29  34.61,56.83 180 top
R30  58.42,56.83 180 top
R31  18.73,49.85 0 top
R32  25.08,49.85 180 top
R33  42.23,48.9 180 top
R34  18.73,48.26 180 top
R35  25.08,48.26 0 top
R36  20.95,47.94 90 top
R37  22.86,47.94 90 top
R38  51.12,46.67 270 top
R39  32.07,46.04 90 top
R40  33.66,46.04 90 top
R41  35.24,46.04 270 top
R42  47.94,44.77 270 top
R43  49.53,44.77 90 top
R44  52.07,43.81 0 top
R45  8.57,36.83 180 top
R46  21.59,36.83 180 top
R47  34.61,36.83 180 top
R48  47.62,36.83 180 top
R49  60.64,36.83 180 top
R50  15.88,24.13 90 top
R51  37.78,12.06 0 top
R52  14.29,9.53 270 top
R53  28.89,9.53 270 top
R54  40.01,2.86 270 top
R55  42.23,2.86 90 top
R56  55.24,2.86 90 top
R57  16.19,8.26 270 top
SJ1  53.98,12.38 180 top
SW1  6.67,101.28 90 top
SW2  62.55,101.28 90 top
SW3  43.5,99.06 270 top
SW4  50.16,99.06 90 top
U$2  [ROHS_BIG]  32.07,58.1 0 bottom

### Tracks (layer width: path | path; a pad name or v marks a point on that pad's centre or on a via)
+3V3  (via drill 0.6)
  Top 0.254: SW4.B' SW4.B 48.16,93.57 47.62,93.03 47.62,92.5 | 47.62,92.5 R6.2 | C10.1 40.86,82.35 IC2.64 | C11.1 27.39,80.22 IC2.19 30.27,80.22 v30.48,80.01 | v39.69,83.82 39.69,84.45 40.64,85.41 42.86,85.41 43.5,86.04 47.94,86.04 v48.26,85.72 | v47.62,89.85 47.62,92.5 | v41.27,65.41 41.38,65.51 IC6.1 | 10.79,86.04 R8.2 | D3.2 26.99,53.34 27.3,53.02 29.84,53.02 32.07,55.24 32.07,63.18 30.16,65.09 30.16,67.94 29.84,68.26 29.84,72.39 | v42.23,68.58 43.08,69.43 R16.2 | IC2.48 38.82,71.44 39.37,71.44 40.11,72.17 40.11,72.61 | 29.84,72.39 29.84,72.71 30.48,73.34 v30.48,73.66 | 29.01,72.41 C20.1 | 29.01,72.41 IC2.32 | 29.01,72.41 29.03,72.39 29.84,72.39
  Top 0.305: 52.04,68.9 C21.+ 52.04,68.87 51.75,68.58 51.75,66.99 C25.1 50.48,66.99 49.21,65.72 49.21,65.09 49.44,64.86 IC6.27
  Top 0.406: 8.12,87.31 C8.+ | 8.12,87.31 C6.1 9.84,87.21 9.84,86.36 10.16,86.04 10.79,86.04 13.97,86.04 14.61,86.68 24.77,86.68 25.72,87.63 L3.1 26.41,86.41 v26.35,86.36 | v41.27,65.41 C27.1 | C10.1 | C10.1 39.37,82.55 37.15,80.33 37.15,77.15 37.78,76.52 37.78,74.93 40.11,72.61 C17.1 C18.1 42.33,72.71 42.55,72.71 43.66,71.6 R16.2 | C10.1 40.96,82.65 | v39.69,83.82 40.96,82.55 C10.1 | 8.12,87.31 8.12,87.77 5.44,90.45 IC1.3 | 49.53,68.9 52.04,68.9 | 49.53,68.9 49.53,72.39 48.9,73.03 JP1.1 | R16.2 43.55,69.53 | R16.2 R17.2 45.19,69.53 45.72,69.53 46.35,68.9 46.35,67.31 46.67,66.99 49.21,66.99 49.53,67.31 49.53,68.9
  Bottom 0.254: v48.26,85.72 47.62,86.36 v47.62,89.85
  Bottom 0.406: v42.23,68.58 41.27,67.63 v41.27,65.41 | v26.35,86.36 29.84,82.87 30.48,82.87 | 30.48,82.87 v30.48,80.01 v30.48,73.66 | v39.69,83.82 38.73,82.87 30.48,82.87
+3V3_A  (via drill 0.6)
  Top 0.254: 45.09,60.96 45.09,57.78 44.36,57.06 IC6.14 | L3.2 31.75,87.63 32.07,87.31 32.07,86.58 C7.1 C9.1 32.38,84.99 32.38,84.45 32.67,84.17 IC2.13 | 64.41,75.29 IC4.16 63.5,76.21 C13.1 62.13,76.94 61.91,77.15 60.99,77.15 C12.+ 59.66,77.12 v59.05,76.52 58.1,76.52 57.78,76.2 57.78,74.93 56.83,73.98 55.56,73.98 53.66,75.88 53.66,76.97 R10.P$1 | R50.2 15.88,26.35 15.24,26.99 C46.+
  Top 0.305: v47.31,60.96 45.09,60.96 IC6.8 41.38,60.96 C31.1 C30.1
  Top 0.406: R45.P$1 11.11,30.09 11.11,29.21 12.17,28.16 C48.1 15.17,28.16 C46.+ 15.85,28.23 15.88,28.26 24.13,28.26 | 24.13,28.26 37.15,28.26 | 37.15,28.26 50.16,28.26 | R46.P$1 24.13,30.09 24.13,28.26 | R47.P$1 37.15,30.09 37.15,28.26 | R48.P$1 50.16,30.09 50.16,28.26 | 59.69,60.96 v61.28,62.55 | 59.69,60.96 59.69,54.61 60.92,53.38 R30.P$1 | 59.69,60.96 v54.61,60.96 | IC7.4 21.91,52.7 21.06,51.85 C37.1 20.95,51.33 v20.95,50.16 | L3.2 27.94,87.56 27.94,86.36 26.99,85.41 25.08,85.41 24.77,85.72 21.91,85.72 20.6,84.42 R9.P$1 | v20.64,72.71 18.1,70.17 6.35,70.17 v6.03,70.48 5.18,71.33 C19.1 4.13,72.71 4.5,73.08 IC5.8 5.4,73.03 | v13.34,43.18 v20.95,43.18 24.13,43.18 28.29,47.34 C41.+ 29.21,49.85 31.11,51.75 36.2,51.75 | 36.2,51.75 36.2,58.74 38.31,60.86 C30.1 | R29.P$1 36.83,50.11 36.83,51.12 36.2,51.75 | v8.26,61.91 8.26,58.42 13.29,53.38 R28.P$1 | v59.05,37.62 59.21,37.47 60.64,37.47 61.28,36.83 61.28,34.45 63.18,32.54 63.18,30.17 R49.P$1 63.14,28.85 62.55,28.26 55.98,28.26 C47.1 55.78,28.26 50.16,28.26 | C44.1 60.64,43.6 60.64,44.13 60.96,44.45 v60.96,45.72
  Bottom 0.406: v59.05,37.62 59.05,42.55 60.96,44.45 v60.96,45.72 60.96,49.79 R30.P$1 60.96,49.87 | v59.05,76.52 59.05,70.48 61.28,68.26 v61.28,62.55 | v54.61,60.96 v47.31,60.96 | v20.64,72.71 20.6,72.75 R9.P$1 | R28.P$1 13.34,49.79 v13.34,43.18 | v20.95,43.18 v20.95,50.16 | v8.26,61.91 6.03,64.14 v6.03,70.48
AREF_-10  (via drill 0.6)
  Top 0.254: R23.2 R24.2 v22.86,62.55 | R36.2 R37.2 v22.86,50.16 | v22.86,67.63 22.54,67.31 16.51,67.31 13.34,64.14 v12.7,64.14 12.48,63.92 R20.2 | v10.79,73.03 11.12,73.34 IC3.2 11.21,74.54 C15.1 R12.2 9.63,77.47 R15.2
  Bottom 0.254: v22.86,50.16 v22.86,62.55 v22.86,67.63 | v12.7,64.14 12.7,71.12 v10.79,73.03
AUX_OUT
  Top 0.254: 43.16,57.78 IC6.13 42.15,57.71 41.91,57.47 41.91,56.52 42.23,56.2 42.86,56.2 44.42,54.64 C33.+
BOOT_FLASH  (via drill 0.6)
  Top 0.254: SW4.A' SW4.A 52.16,93.76 52.07,93.66 52.07,92.5 R7.2 51.97,89.95 v52.07,89.85 | v60.33,89.85 60.01,89.53 60.01,83.5 55.73,79.22 IC2.60
  Bottom 0.254: v60.33,89.85 v52.07,89.85
BRIGHTNESS_ATT  (via drill 0.6)
  Top 0.254: v58.42,33.97 57.94,33.5 10.32,33.5 8.57,31.75 R45.P$2 | v62.87,73.66 61.88,74.64 IC4.2
  Bottom 0.254: v58.42,33.97 58.74,34.29 60.96,34.29 61.59,34.92 61.59,38.42 65.09,41.91 65.09,71.44 v62.87,73.66
BRIGHTNESS_CV
  Top 0.254: IC2.14 32.17,82.02 31.75,81.6 30.16,81.6 28.26,83.5 26.04,83.5 25.72,83.19 25.72,80.33 23.18,77.79 23.18,73.66 19.05,69.53 5.71,69.53 5.4,69.22 IC5.1 5.4,64.14 5.71,63.82 6.25,63.82 C26.2 R18.1
BRIGHTNESS_POT  (via drill 0.6)
  Top 0.254: v10.79,34.92 11.59,34.13 57.31,34.13 58.1,34.92 60.01,34.92 v60.33,35.24 | v61.28,73.66 60.96,73.34 IC4.4
  Bottom 0.254: v10.79,34.92 10.79,37.78 11.75,38.73 11.75,40.96 10.79,41.91 R28.P$2 | v60.33,35.24 60.96,35.88 60.96,38.73 64.45,42.23 64.45,52.07 61.28,55.24 61.28,57.78 64.45,60.96 64.45,71.12 62.87,72.71 62.23,72.71 v61.28,73.66
CV_NORMALIZATION
  Top 0.254: R57.2 16.41,7.62 18.41,7.62 20.32,9.53 J7.P2
DAMP_ATT  (via drill 0.6)
  Top 0.254: R47.P$2 34.61,31.43 35.4,32.23 60.48,32.23 v60.96,32.7 | v66.04,73.34 IC4.13
  Bottom 0.254: v60.96,32.7 61.28,33.02 62.23,33.02 62.87,33.66 62.87,37.78 66.36,41.27 66.36,73.03 v66.04,73.34
DAMP_CV
  Top 0.254: R25.1 C28.2 17.88,61.49 18.1,61.28 IC7.14 18.1,58.42 18.41,58.1 25.72,58.1 26.35,58.74 26.35,60.96 27.62,62.23 27.62,66.36 24.45,69.53 24.45,77.15 26.52,79.22 IC2.21
DAMP_POT  (via drill 0.6)
  Top 0.254: v58.9,35.88 58.26,35.88 57.15,34.77 37.94,34.77 35.56,37.15 v35.56,38.1 | v60.96,72.07 60.34,72.69 IC4.5
  Bottom 0.254: v58.9,35.88 59.53,35.88 60.33,36.67 60.33,39.05 63.82,42.55 63.82,51.75 60.64,54.93 60.64,58.1 63.82,61.28 63.82,70.8 62.55,72.07 v60.96,72.07 | v35.56,38.1 35.56,44.45 34.61,45.4 R29.P$2
FM_CV
  Top 0.254: IC7.8 25.72,61.28 25.93,61.49 C29.2 R26.1 26.67,63.82 26.99,64.14 26.99,66.04 23.81,69.22 23.81,77.47 26.06,79.72 IC2.20
FREQUENCY_ATT  (via drill 0.6)
  Top 0.254: R46.P$2 21.59,31.43 23.02,32.86 59.21,32.86 v59.69,33.34 | v62.55,75.25 62.5,75.29 IC4.1
  Bottom 0.254: v59.69,33.34 60.01,33.66 61.28,33.66 62.23,34.61 62.23,38.1 65.72,41.59 65.72,72.07 v62.55,75.25
FREQUENCY_POT  (via drill 0.6)
  Top 0.254: 33.66,83.43 IC2.11 33.67,84.44 33.34,84.77 33.34,87 32.07,88.27 28.89,88.27 28.57,88.58 25.72,88.58 24.45,87.31 20.64,87.31 v20.32,87.63 | v20.32,85.72 20,85.41 20,79.06 19.37,78.42 18.41,78.42 18.1,78.11 R9.P$2
  Bottom 0.254: v20.32,85.72 v20.32,87.63
GEOMETRY_ATT  (via drill 0.6)
  Top 0.254: R48.P$2 47.62,31.43 47.78,31.59 61.75,31.59 v62.23,32.07 | v66.67,74.61 66.04,74.61 65.42,73.99 IC4.14
  Bottom 0.254: v62.23,32.07 63.18,32.07 66.99,35.88 66.99,74.3 v66.67,74.61
GEOMETRY_CV
  Top 0.254: R31.1 C36.2 17.88,52.17 18.1,52.39 IC7.1 18.1,54.93 20.64,57.47 26.04,57.47 26.99,58.42 26.99,60.64 28.26,61.91 28.26,66.67 25.08,69.85 25.08,76.83 26.97,78.72 IC2.22
GEOMETRY_POT  (via drill 0.6)
  Top 0.254: v34.29,80.96 34.29,82.23 34.17,82.35 IC2.10
  Bottom 0.254: v34.29,80.96 35.56,80.96 36.2,80.33 36.2,79.38 38.73,76.83 45.4,76.83 46.99,78.42 50.8,78.42 51.12,78.11 R10.P$2
GND  (via drill 0.6)
  Top 0.254: C31.2 41.38,59.05 42.23,59.05 42.27,59.01 IC6.11
  other vias: 36.51,65.41 41.27,69.53 57.15,72.07 58.42,78.42 37.78,58.74 21.27,61.91 27.62,77.15 26.99,71.75 28.26,82.23 24.13,56.2 10.48,67.94 44.13,81.6 29.21,86.04 53.34,50.16 48.26,48.58 32.38,43.18 3.81,86.36 13.34,93.03 13.34,72.71 43.81,95.57 32.38,93.34 50.16,93.98 43.5,101.6 22.86,92.08 19.37,92.08 33.81,73.82 34.29,61.28 31.75,78.11 45.09,64.14 57.15,43.81 38.73,41.91 21.59,56.2 15.56,92.08 26.67,92.08 18.73,57.15 12.06,52.7 13.97,61.59 10.48,88.9 58.42,62.23 27.62,44.13 1.27,45.72 1.27,55.88 1.27,60.96 1.27,73.98 1.27,101.6 6.35,105.41 62.23,105.41 67.94,101.6 1.27,15.24 1.27,5.08 5.08,1.27 25.4,1.27 50.8,1.27 67.94,5.08 63.5,21.59 62.23,46.67 61.28,60.64 57.15,87.63 22.86,81.28 40.01,92.71 21.59,70.17 34.29,54.61 56.2,47.62 57.15,54.61 27.94,30.48 41.27,30.48 53.98,30.48 27.94,26.35 12.7,20.32 27.94,21.59 41.27,21.59 53.98,21.59 15.24,21.59 27.94,5.71 53.34,5.71 37.15,81.92 45.4,78.11 59.69,46.67 48.26,60.01 5.08,50.8 6.03,96.84 1.27,95.89 1.27,93.98 1.27,92.08 1.27,90.17 1.27,88.27 3.81,88.27 5.4,88.27 1.27,86.36 5.4,86.36 6.99,86.36 57.15,66.99 62.55,66.99 53.98,69.85 5.08,60.96 41.27,26.67 53.98,26.67 15.24,5.71 16.51,32.38 10.48,71.75 27.62,56.83 13.34,87.31
  pour Bottom: 0,106.68 0,0 69.22,0 69.22,106.68
  pour Top: 0,106.68 69.22,106.68 69.22,0 0,0
I2C_SCL  (via drill 0.6)
  Top 0.254: IC6.24 50.7,62.87 48.58,62.87 44.77,66.67 44.13,66.67 43.66,67.15 R16.1 43.55,67.63 36.2,67.63 35.56,68.26 v35.56,68.9 | v33.02,76.52 32.38,75.88 31.43,75.88 30.77,75.22 IC2.29
  Bottom 0.254: v33.02,76.52 33.02,74.3 32.7,73.98 32.7,70.8 33.97,69.53 34.92,69.53 v35.56,68.9
I2C_SDA  (via drill 0.6)
  Top 0.254: IC6.23 50.71,62.23 48.26,62.23 47.47,63.02 | v32.07,74.93 31.86,74.72 IC2.30 | v34.29,68.58 34.29,67.94 34.92,67.94 35.88,66.99 42.86,66.99 43.81,66.04 44.45,66.04 47.47,63.02 | R17.1 45.09,67.31 48.26,64.14 v48.58,64.14 | v46.67,62.55 46.99,62.55 47.47,63.02 | 47.47,63.02
  Bottom 0.254: v34.29,68.58 33.97,68.58 32.07,70.48 v32.07,74.93 | v48.58,64.14 46.99,62.55 v46.67,62.55
I2S_LRCK
  Top 0.254: IC6.5 44.41,62.91 44.77,62.55 44.77,61.91 44.45,61.59 43.25,61.59 IC6.7 43.22,61.59 42.23,61.59 41.59,62.23 35.24,62.23 32.38,65.09 32.07,65.09 31.43,65.72 31.43,68.58 31.18,68.84 IC2.33
I2S_SCK  (via drill 0.6)
  Top 0.254: IC6.3 43.16,64.14 36.2,64.14 34.92,65.41 v34.92,66.04 | v32.38,66.04 32.07,66.36 32.07,68.9 31.68,69.29 IC2.34
  Bottom 0.254: v32.38,66.04 v34.92,66.04
I2S_SIN
  Top 0.254: IC6.6 43.21,62.23 42.23,62.23 41.59,62.87 35.56,62.87 33.34,65.09 33.34,66.67 32.7,67.31 32.7,69.22 32.17,69.74 IC2.35
I2S_SOUT
  Top 0.254: 43.18,63.5 IC6.4 35.82,63.56 33.97,65.41 33.97,66.99 33.34,67.63 33.34,69.53 32.67,70.19 IC2.36
IN_1
  Top 0.254: R27.1 52.16,60.31 IC6.20
IN_2
  Top 0.254: IC6.19 50.71,59.69 49.53,59.69 48.58,58.74 48.58,54.61 49.21,53.98 49.21,50.16 50.48,48.9 52.07,48.9 52.67,48.29 C40.+
JTCK  (via drill 0.6)
  Top 0.254: v44.13,72.71 43.12,73.72 IC2.49
  Bottom 0.254: v44.13,72.71 44.45,72.39 46.04,72.39 46.67,71.75 JP1.4
JTDI
  Top 0.254: JP1.8 46.99,69.22 45.72,70.48 45.72,72.71 44.21,74.22 IC2.50
JTDO
  Top 0.254: JP1.6 46.35,71.44 46.35,73.03 42.66,76.72 IC2.55
JTMS  (via drill 0.6)
  Top 0.254: v37.78,73.34 37.67,73.23 IC2.46
  Bottom 0.254: JP1.2 45.4,73.03 44.77,73.66 43.5,73.66 43.18,73.34 v37.78,73.34
MAIN_OUT
  Top 0.254: IC6.12 42.17,58.36 41.27,57.47 41.27,56.2 41.59,55.88 C32.+
MUX_ADDR_0
  Top 0.254: IC4.11 64.39,72.07 63.18,72.07 61.28,70.17 57.63,70.17 52.86,74.93 46.99,74.93 43.2,78.72 IC2.59
MUX_ADDR_1
  Top 0.254: IC4.10 63.45,71.39 61.59,69.53 57.47,69.53 52.55,74.45 46.67,74.45 42.91,78.22 IC2.58
MUX_ADDR_2
  Top 0.254: IC4.9 63.76,70.74 61.91,68.9 57.31,68.9 52.23,73.98 46.35,73.98 42.61,77.72 IC2.57
MUXED_POTS  (via drill 0.6)
  Top 0.254: 58.76,73.98 IC4.3 57.8,73.99 57.15,73.34 55.24,73.34 53.02,75.56 47.31,75.56 46.67,76.2 v46.67,76.52 | IC2.9 34.67,82.48 34.92,82.23 34.92,81.6 35.24,81.28 v35.24,79.69
  Bottom 0.254: v35.24,79.69 35.24,79.38 38.42,76.2 46.35,76.2 v46.67,76.52
N$1
  Top 0.254: J1.P3 6.03,16.51 2.22,20.32 2.22,39.37 10.48,47.62 13.97,47.62 14.92,48.58 14.92,53.02 9.53,58.42 R19.2
N$2
  Top 0.254: R20.1 R19.1 R18.2 C26.1 6.35,66.36 6.67,66.67 IC5.2
N$3
  Top 0.254: J7.P3 11.43,1.91 9.84,3.49 5.71,3.49 5.08,4.13 5.08,16.51 1.59,20 1.59,39.69 6.67,44.77 6.67,52.39 3.17,55.88 3.17,74.3 2.54,74.93 2.54,77.47 3.49,78.42 7.62,78.42 7.94,78.11 R14.2
N$4
  Top 0.254: R22.2 25.93,66.14 25.4,66.67 17.46,66.67 16.19,65.41 16.19,60.96 13.65,58.42 13.65,55.56 15.56,53.66 15.56,48.26 14.29,46.99 10.79,46.99 6.35,42.55 6.35,36.2 2.86,32.7 2.86,20.64 5.71,17.78 9.21,17.78 9.84,17.14 19.68,17.14 20.32,16.51 J2.P3
N$5
  Top 0.254: IC7.9 24.45,61.28 24.23,61.49 C29.1 R26.2 R22.1 24.02,65.62 R24.1
N$6
  Top 0.254: R34.2 17.88,47.41 16.19,45.72 11.43,45.72 7.62,41.91 7.62,35.56 4.13,32.07 4.13,21.27 6.35,19.05 9.84,19.05 10.48,18.41 22.54,18.41 23.18,17.78 35.24,17.78 35.88,17.14 45.72,17.14 46.35,16.51 J4.P3
N$7
  Top 0.254: IC2.5 36.67,87.47 37.78,88.58 41.27,88.58 41.97,89.28 Q1.2 43.81,89.85 C5.2
N$8
  Top 0.254: IC2.6 36.17,87.33 34.92,88.58 33.02,88.58 32.32,89.28 Q1.1 30.16,89.85 C4.2
N$9
  Top 0.254: J6.P3 6.35,1.91 4.45,3.81 4.45,16.19 0.95,19.68 0.95,40.01 6.03,45.09 6.03,52.07 2.54,55.56 2.54,73.98 1.91,74.61 1.91,78.11 4.45,80.64 R11.1
N$10
  Top 0.254: R21.2 17.14,65.41 16.83,65.09 16.83,61.59 17.46,60.96 17.46,55.56 16.19,54.29 16.19,47.94 14.61,46.35 11.11,46.35 6.99,42.23 6.99,35.88 3.49,32.38 3.49,20.95 6.03,18.41 9.53,18.41 10.16,17.78 22.23,17.78 22.86,17.14 32.7,17.14 33.34,16.51 J3.P3
N$11
  Top 0.254: IC7.13 19.37,61.28 19.58,61.49 C28.1 R25.2 R21.1 19.8,65.62 R23.1
N$12
  Top 0.254: R1.2 11.01,102.23 12.38,102.23 13.02,102.87 LED1.3
N$13
  Top 0.254: C22.1 37.78,70.17 38.17,70.56 IC2.47
N$14
  Top 0.254: C14.1 R13.2 R14.1 | R14.1 R15.1 | R14.1 IC5.6
N$15
  Top 0.254: IC7.2 19.37,52.39 19.58,52.17 C36.1 R31.2 R34.1 19.58,47.41 20,46.99 20.85,46.99 R36.1
N$16
  Top 0.406: IC1.2 12.79,95.25 14.92,95.25 16.37,96.7 C2.+ 17.46,98.11 16.83,98.74 R2.1
N$17
  Top 0.254: IC6.16 50.67,57.78 49.53,57.78 49.21,57.47 49.21,55.24 49.82,54.64 C34.+ 50.51,54.61 51.75,54.61 52.17,54.19 C35.1
N$18  (via drill 0.6)
  Top 0.254: R54.1 40.01,7.62 38.63,8.99 R51.2 C49.1 41.91,13.65 42.86,14.61 63.18,14.61 v64.14,15.56 | v64.14,12.38 64.45,12.7 66.04,12.7 68.26,14.92 68.26,38.42 64.45,42.23 54.93,42.23 53.98,43.18 53.98,44.45 53.66,44.77 C40.-
  Bottom 0.254: v64.14,15.56 63.82,15.24 63.82,14.92 63.82,13.02 63.82,12.7 v64.14,12.38
N$19
  Top 0.254: C16.1 27.55,74.22 IC2.31
N$20
  Top 0.254: R52.2 14.19,8.57 13.02,8.57 12.06,9.53 J6.P2
N$21
  Top 0.254: J8.P3 34.71,2.01 R54.2
N$22
  Top 0.254: R3.2 11.01,100.33 12.38,100.33 13.02,99.69 LED1.1
N$23
  Top 0.254: C33.- 46.04,49.85 46.35,49.53 48.58,49.53 49.53,48.58 R43.2 49.73,45.82 R38.2
N$24
  Top 0.406: D1.A 19.32,103.45 L1.1
N$25
  Top 0.254: IC8.6 45.4,44.45 45.94,43.92 C43.1 R42.2 R43.1 49.63,43.81 R44.1
N$26
  Top 0.254: J5.P3 49.53,16.51 48.26,17.78 36.2,17.78 35.56,18.41 23.5,18.41 22.86,19.05 15.88,19.05 9.53,25.4 6.67,25.4 4.76,27.3 4.76,31.75 8.26,35.24 8.26,41.59 11.75,45.09 23.81,45.09 25.93,47.2 R35.2
N$27
  Top 0.254: LED2.3 54.29,101.38 R4.2
N$28
  Top 0.254: R42.1 C43.2 45.51,45.62 45.4,45.72 IC8.7 42.86,45.72 42.55,45.4 42.55,42.23 43.18,41.59 64.14,41.59 67.63,38.1 67.63,15.24 65.72,13.34 63.82,13.34 61.28,10.79 57.15,10.79 55.24,8.89 R56.2
N$29
  Top 0.254: J10.P3 60.54,2.01 R56.1
N$30
  Top 0.254: R37.1 22.96,46.99 23.81,46.99 24.23,47.41 R35.1 R32.2 C38.1 24.23,52.17 24.45,52.39 IC7.6
N$31
  Top 0.254: R40.2 33.66,47.62 34.29,48.26 39.37,48.26 40.01,48.9 R33.2 41.59,49.11 C32.-
N$32
  Top 0.254: IC8.2 37.78,45.72 37.25,45.19 C42.1 R41.2 R40.1 R39.1
N$33
  Top 0.254: R55.2 42.23,10.48 45.72,13.97 63.82,13.97 66.36,16.51 66.36,32.38 62.87,35.88 62.87,38.1 60.64,40.32 42.55,40.32 41.27,41.59 41.27,46.04 40.32,46.99 IC8.1 36.93,46.99 C42.2 R41.1
N$34
  Top 0.254: J9.P3 47.52,2.01 R55.1
N$35
  Top 0.254: LED2.1 55.88,98.97 R5.2
N$36
  Top 0.406: D2.C 38.78,103.45 L2.1
N$37  (via drill 0.6)
  Top 0.254: v38.73,79.38 38.42,79.06 38.42,77.79 39.05,77.15 39.05,75.88 39.72,75.22 IC2.52 | v49.53,81.92 49.53,83.19 56.52,90.17 56.52,94.93 57.15,95.57 57.15,103.82 56.52,104.46 14.61,104.46 13.97,103.82 13.97,98.74 13.34,98.11 12.38,98.11 11.75,98.74 10.9,98.74 R3.1
  Bottom 0.254: v38.73,79.38 39.05,79.38 39.69,80.01 48.26,80.01 49.53,81.28 v49.53,81.92
N$38
  Top 0.254: R50.1 15.98,23.18 17.78,23.18 18.73,24.13 J2.P2
N$39
  Top 0.254: J8.P2 31.75,9.53 30.9,8.68 R53.2
N$40  (via drill 0.6)
  Top 0.254: R4.1 54.29,90.17 52.39,88.27 41.91,88.27 41.59,87.95 38.42,87.95 v37.78,87.31 | v34.61,85.09 35.17,84.52 IC2.8
  Bottom 0.254: v37.78,87.31 35.56,85.09 v34.61,85.09
N$41
  Top 0.254: IC6.25 52.33,63.56 52.39,63.5 59.37,63.5 60.96,65.09 Q3.2 64.77,65.15 64.77,66.36 65.3,66.89 C24.2
N$42
  Top 0.254: IC6.26 52.15,64.21 52.39,64.45 55.24,64.45 55.24,65.02 Q3.1 55.18,66.74 54.29,67.63 54.29,68.16 C23.2
N$43  (via drill 0.6)
  Top 0.254: v39.37,78.11 39.37,77.79 39.69,77.47 39.69,76.2 40.17,75.72 IC2.53 | v50.8,81.6 50.8,83.5 57.15,89.85 57.15,94.61 57.78,95.25 57.78,104.14 56.83,105.09 11.43,105.09 10.79,104.46 R1.1
  Bottom 0.254: v39.37,78.11 39.37,78.74 40.01,79.38 48.58,79.38 v50.8,81.6
N$44  (via drill 0.6)
  Top 0.254: R5.1 55.88,90.49 48.26,82.87 v48.26,82.23 | v39.05,80.64 38.73,80.64 37.78,79.69 37.78,77.47 38.42,76.83 38.42,75.56 39.26,74.72 IC2.51
  Bottom 0.254: v39.05,80.64 47.94,80.64 48.26,80.96 v48.26,82.23
N$45  (via drill 0.6)
  Top 0.254: v31.75,39.37 32.07,39.69 60.33,39.69 62.39,37.62 62.39,35.4 65.72,32.07 65.72,19.68 v64.14,18.1 | R39.2 31.96,46.99 31.43,46.99 30.8,46.35 v30.8,43.18
  Bottom 0.254: v30.8,43.18 31.75,42.23 v31.75,39.37 | v64.14,18.1 63.18,17.14 63.18,10.79 61.91,9.53 J10.P2
N$46  (via drill 0.6)
  Top 0.254: R44.2 53.02,43.71 v53.02,42.47 | v62.23,17.78 65.09,20.64 65.09,31.75 61.91,34.92 61.91,37.15 60.01,39.05 50.48,39.05 v50.16,38.73 | SJ1.1 57.15,12.38 58.1,13.34 61.91,13.34 v62.23,13.02
  Bottom 0.254: v62.23,13.02 62.55,13.34 62.55,17.46 v62.23,17.78 | 50.32,38.89 v50.16,38.73 50.16,39.61 v53.02,42.47
N$47
  Top 0.254: J9.P2 49.53,9.53 52.39,12.38 SJ1.2
N$56
  Top 0.406: 23.5,101.92 JP3.2 | 23.5,101.92 JP3.1 | L1.2 20.7,101.92 23.5,101.92
N$64
  Top 0.406: JP3.10 33.66,101.92 | 33.66,101.92 JP3.9 | L2.2 37.4,101.92 33.66,101.92
N$66
  Top 0.254: R11.2 9.21,80.64 9.84,81.28 Q2.B
NORMALIZATION_PROBE  (via drill 0.6)
  Top 0.254: v6.99,32.38 6.99,33.02 8.89,34.92 8.89,41.27 12.06,44.45 24.13,44.45 26.99,47.31 26.99,49.85 27.94,50.8 D3.3 28.09,52.07 29.84,52.07 32.7,54.93 32.7,63.5 30.8,65.41 30.8,68.26 30.48,68.58 30.48,72.39 30.8,72.71 33.97,72.71 34.17,72.5 IC2.39 | v7.3,14.61 9.21,14.61 13.44,10.38 R52.1 14.5,10.16 16.19,10.16 | 16.19,10.16 20.32,10.16 20.95,10.79 22.23,10.79 22.64,10.38 R53.1 | 16.19,10.16 R57.1
  Bottom 0.254: v6.99,32.38 4.76,32.38 3.49,31.11 3.49,18.41 v7.3,14.61
POSITION_ATT  (via drill 0.6)
  Top 0.254: v67.63,76.2 66.67,76.2 65.12,74.64 IC4.15
  Bottom 0.254: R49.P$2 60.64,29.21 61.59,28.26 64.14,28.26 66.36,30.48 66.36,34.29 67.63,35.56 v67.63,76.2
POSITION_CV
  Top 0.254: R32.1 C38.2 25.93,52.17 25.72,52.39 IC7.7 | IC7.7 25.93,53.98 | IC2.23 27.42,78.22 25.72,76.52 25.72,70.17 28.89,66.99 28.89,61.59 27.62,60.33 27.62,58.1 25.72,56.2 IC7.7
POSITION_POT
  Top 0.254: IC4.12 65.1,72.69 67.94,69.85 67.94,61.91 65.09,59.05 65.09,51.44 61.91,48.26 58.74,48.26 58.42,48.58 R30.P$2
RESET  (via drill 0.6)
  Top 0.254: 45.5,99.06 SW3.B' 45.5,93.25 45.72,93.03 45.72,92.5 R6.1 | 45.5,99.06 SW3.B | v36.51,88.9 36.51,91.44 40.01,94.93 40.01,97.47 41.59,99.06 45.5,99.06 | v34.92,87.31 35.67,86.56 IC2.7 35.67,81.8 36.2,81.28 36.2,79.38 34.61,77.79 v34.61,74.93
  Bottom 0.254: v34.92,87.31 v36.51,88.9 | v34.61,74.93 34.61,74.3 37.15,71.75 42.55,71.75 46.35,67.94 JP1.10
RX  (via drill 0.6)
  Top 0.254: v36.83,75.56 36.83,73.66 36.17,73 IC2.43 | JP2.4 66.67,86.68 66.99,86.36 66.99,83.5 66.36,82.87 61.28,82.87 56.83,78.42 56.83,75.25 v56.52,74.93
  Bottom 0.254: v36.83,75.56 37.47,74.93 44.77,74.93 45.09,74.61 56.2,74.61 v56.52,74.93
STRUM
  Top 0.254: R8.1 10.79,82.55 11.43,81.92 11.75,81.92 12.53,81.13 Q2.C 13.65,80.33 13.97,80.01 13.97,75.25 14.61,74.61 21.59,74.61 21.91,74.93 21.91,78.42 24.45,80.96 24.45,83.82 25.4,84.77 28.89,84.77 30.16,83.5 31.08,83.5 IC2.16
SW_MODE
  Top 0.254: SW2.4 SW2.3 59.37,92.6 59.37,83.82 55.27,79.72 IC2.61
SW_POLYPHONY
  Top 0.254: SW1.4 10.12,105.73 57.15,105.73 58.74,104.14 58.74,84.14 54.82,80.22 IC2.62
  Bottom 0.254: SW1.3 SW1.4
TX  (via drill 0.6)
  Top 0.254: v36.2,77.15 35.88,76.83 35.88,73.66 35.67,73.46 IC2.42 | v55.88,76.2 55.88,78.42 61.59,84.14 JP2.5
  Bottom 0.254: v36.2,77.15 36.51,77.15 38.1,75.56 45.09,75.56 45.4,75.25 54.93,75.25 v55.88,76.2
V_OCT_CV
  Top 0.254: IC2.15 31.68,82.47 31.43,82.23 30.48,82.23 28.57,84.14 25.72,84.14 25.08,83.5 25.08,80.64 22.54,78.11 22.54,74.61 21.91,73.98 20.64,73.98 17.46,70.8 7.62,70.8 6.67,71.75 IC5.7 6.67,74.3 6.35,74.61 4.13,74.61 3.81,74.93 3.81,77.15 4.03,77.37 C14.2 R13.1
VCC  (via drill 0.6)
  Top 0.406: IC8.8 C39.1 46.35,47.09 v46.35,48.26 | v40.01,40.96 39.37,40.32 12.06,40.32 10.79,39.05 v10.16,39.05 | v2.54,99.69 6.35,99.69 6.99,99.06 6.99,97.47 7.94,96.52 13.34,96.52 14.92,98.11 14.92,102.23 15.39,102.7 R2.2 16.83,101.6 17.14,101.28 18.41,101.28 19.05,100.65 20,100.65 23.18,97.47 24.77,97.47 C3.+ 22.68,96.7 20,99.38 D1.C
  Bottom 0.406: v46.35,48.26 46.35,44.77 42.55,40.96 v40.01,40.96 | v10.16,39.05 9.84,39.05 2.54,46.35 v2.54,99.69
VEE  (via drill 0.6)
  Top 0.254: R12.1 13.02,77.57 v13.02,79.06
  Top 0.406: IC8.4 C45.2 36.73,42.44 35.88,41.59 11.11,41.59 v10.16,40.64 | v13.97,88.58 14.92,89.53 26.67,89.53 28.57,91.44 28.57,94.93 30.8,97.16 33.97,97.16 35.56,95.57 C1.- 37.78,95.57 39.05,96.84 D2.A
  Bottom 0.254: 3.81,79.06 v13.02,79.06
  Bottom 0.406: v13.97,88.58 11.75,88.58 3.81,80.64 3.81,79.06 3.81,46.99 v10.16,40.64

### Text on the board
tNames: RESET | SYSBOOT | Rings | cc-by-sa | Émilie Gillet | 2015. v3
bNames: stripe | Red | +12V | GND | -12V | GND | <TX | JTAG | Rings | cc-by-sa Émilie Gillet, 2015. v3